# Altium project LPL_Control_board.PrjPcb
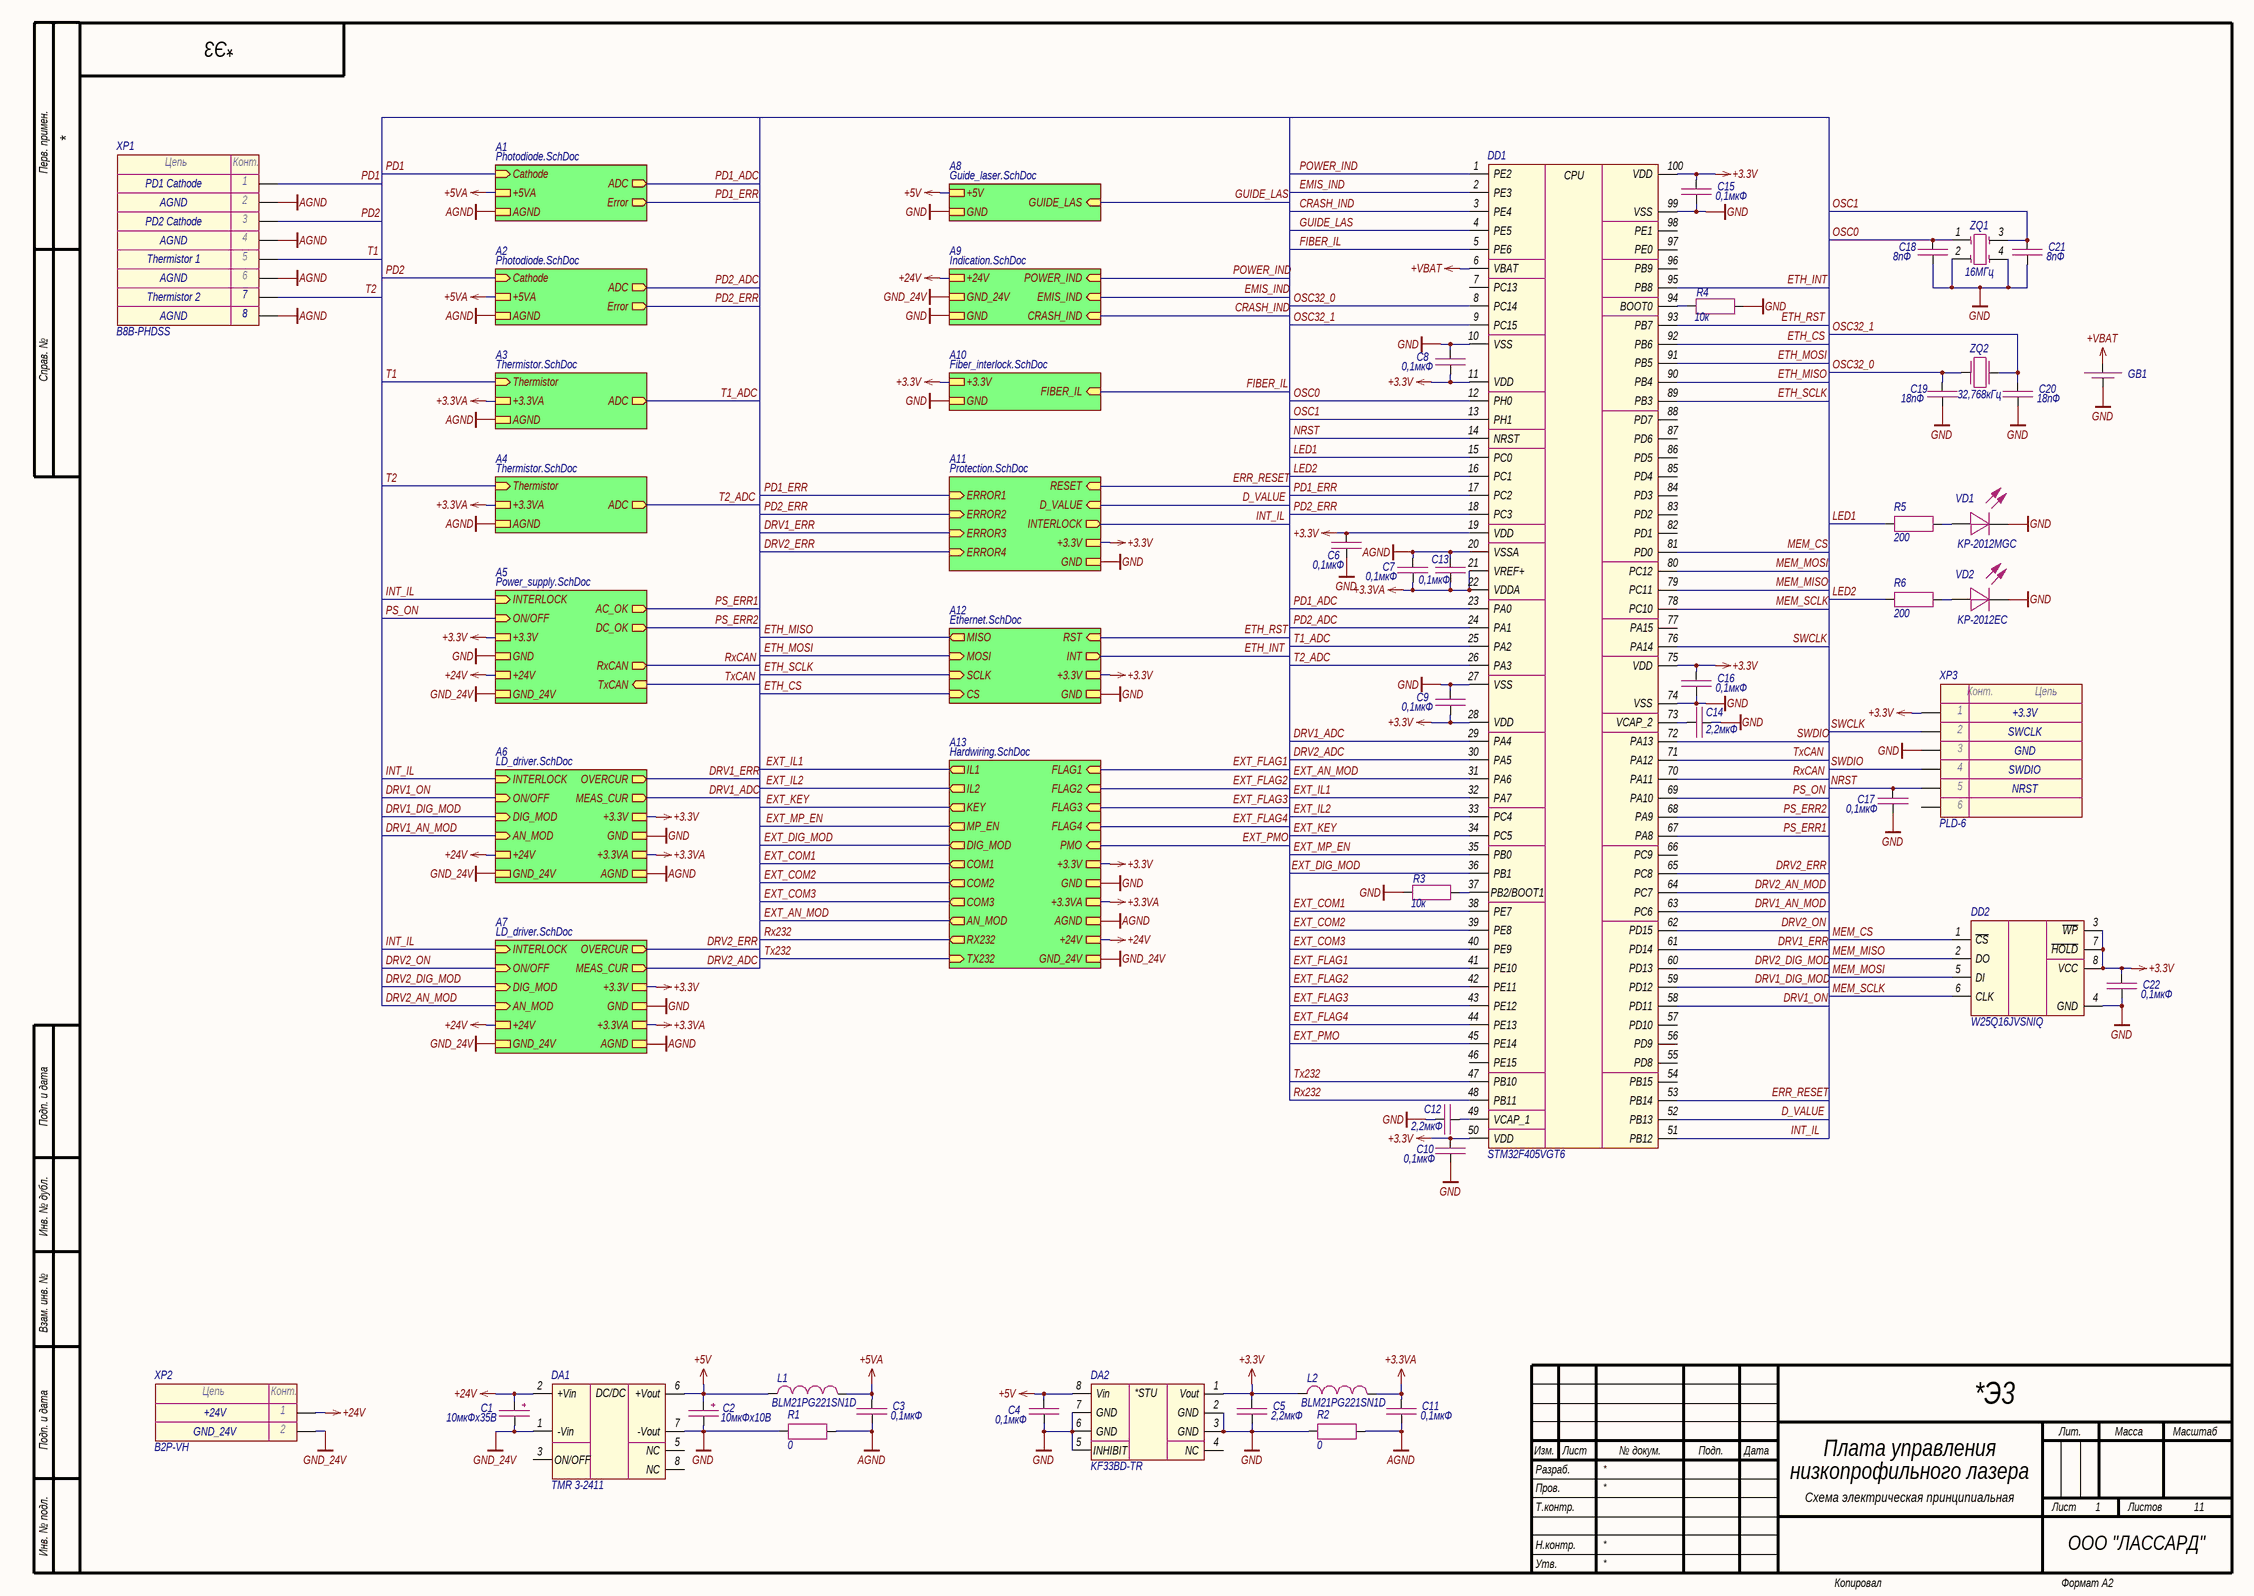
[diagram p0: Main.SchDoc]
11 sheets, 312 parts. Net scope: strictly hierarchical (ports join the sheet entries above them; power ports are local).
Board file: PCB1.PcbDoc
Sheets:
  Main.SchDoc
    A9 = Indication.SchDoc
    A13 = Hardwiring.SchDoc
    A12 = Ethernet.SchDoc
    A1 = Photodiode.SchDoc
    A3 = Thermistor.SchDoc
    A5 = Power_supply.SchDoc
    A6 = LD_driver.SchDoc
    A11 = Protection.SchDoc
    A8 = Guide_laser.SchDoc
    A2 = Photodiode.SchDoc
    A4 = Thermistor.SchDoc
    A7 = LD_driver.SchDoc
    A10 = Fiber_interlock.SchDoc

## Sheet Main.SchDoc: Плата управления
size 594 x 420 mm; CompanyName: ООО "ЛАССАРД"; Address1: Address1; Address2: Address2; Address3: Address3; Address4: Address4; DocumentNumber: *Э3; SheetNumber: 1; SheetTotal: 11; Title2str: низкопрофильного лазера; DocumentType: Схема электрическая принципиальная

### Parts
C1  10мкФх35B  [CAP_C]
C2  10мкФх10B  [CAP_A]
C3  0,1мкФ  [CAP_0603]
C4  0,1мкФ  [CAP_0603]
C5  2,2мкФ  [CAP_0603]
C6  0,1мкФ  [CAP_0603]
C7  0,1мкФ  [CAP_0603]
C8  0,1мкФ  [CAP_0603]
C9  0,1мкФ  [CAP_0603]
C10  0,1мкФ  [CAP_0603]
C11  0,1мкФ  [CAP_0603]
C12  2,2мкФ  [CAP_0603]
C13  0,1мкФ  [CAP_0603]
C14  2,2мкФ  [CAP_0603]
C15  0,1мкФ  [CAP_0603]
C16  0,1мкФ  [CAP_0603]
C17  0,1мкФ  [CAP_0603]
C18  8пФ  [CAP_0603]
C19  18пФ  [CAP_0603]
C20  18пФ  [CAP_0603]
C21  8пФ  [CAP_0603]
C22  0,1мкФ  [CAP_0603]
DA1  TMR 3-2411  [TMR3 (SIP-8)]
DA2  KF33BD-TR  [SOIC-8]
DD1  STM32F405VGT6  [LQFP-100]
DD2  W25Q16JVSNIQ  [SOIC-8]
GB1  DS1092-12-N8S  [DS1092-12-N8S]  (value not drawn)
L1  BLM21PG221SN1D  [IND_0805]
L2  BLM21PG221SN1D  [IND_0805]
R1  0  [RES_0805]
R2  0  [RES_0805]
R3  10к  [RES_0603]
R4  10к  [RES_0603]
R5  200  [RES_0603]
R6  200  [RES_0603]
VD1  KP-2012MGC  [LED_0805]
VD2  KP-2012EC  [LED_0805]
XP1  B8B-PHDSS  [B8B-PHDSS]
XP2  B2P-VH  [B2P-VH]
XP3  PLD-6  [PLD-6]
ZQ1  16МГц  [NX2520SA]
ZQ2  32,768кГц  [NX3215SA]

### Sub-sheets
A1 = Photodiode.SchDoc: Cathode (in), ADC (out), Error (out), AGND, +5VA
A2 = Photodiode.SchDoc: Cathode (in), ADC (out), Error (out), AGND, +5VA
A3 = Thermistor.SchDoc: Thermistor (in), +3.3VA, AGND, ADC (out)
A4 = Thermistor.SchDoc: Thermistor (in), +3.3VA, AGND, ADC (out)
A5 = Power_supply.SchDoc: ON/OFF (in), INTERLOCK (in), +3.3V, GND, +24V, GND_24V, AC_OK (out), DC_OK (out), RxCAN (out), TxCAN (in)
A6 = LD_driver.SchDoc: ON/OFF (in), INTERLOCK (in), DIG_MOD (in), AN_MOD (in), +3.3V, GND, OVERCUR (out), MEAS_CUR (out), +24V, GND_24V, +3.3VA, AGND
A7 = LD_driver.SchDoc: ON/OFF (in), INTERLOCK (in), DIG_MOD (in), AN_MOD (in), +3.3V, GND, OVERCUR (out), MEAS_CUR (out), +24V, GND_24V, +3.3VA, AGND
A8 = Guide_laser.SchDoc: GUIDE_LAS (in), +5V, GND
A9 = Indication.SchDoc: GND_24V, +24V, CRASH_IND (in), POWER_IND (in), EMIS_IND (in), GND
A10 = Fiber_interlock.SchDoc: FIBER_IL (in), +3.3V, GND
A11 = Protection.SchDoc: ERROR1 (in), +3.3V, GND, ERROR2 (in), ERROR3 (in), ERROR4 (in), INTERLOCK (out), RESET (in), D_VALUE (in)
A12 = Ethernet.SchDoc: MISO (out), RST (in), MOSI (in), INT (out), SCLK (in), CS (in), +3.3V, GND
A13 = Hardwiring.SchDoc: IL1 (out), FLAG1 (in), RX232 (out), TX232 (in), IL2 (out), KEY (out), MP_EN (out), AN_MOD (out), FLAG2 (in), FLAG3 (in), FLAG4 (in), PMO (in), +3.3VA, AGND, +3.3V, GND, GND_24V, +24V, COM1 (out), COM2 (out), COM3 (out), DIG_MOD (out)

### Nets
+3.3V: C5.1 C6.1 C8.2 C9.2 C10.2 C15.1 C16.1 C22.1 DA2.1(Vout) DD1.11(VDD) DD1.19(VDD) DD1.28(VDD) DD1.50(VDD) DD1.75(VDD) DD1.100(VDD) DD2.3(~{WP}) DD2.7(~{HOLD}) DD2.8(VCC) L2.1 XP3.1 ; sheet A13/+3.3V, sheet A12/+3.3V, sheet A5/+3.3V, sheet A6/+3.3V, sheet A11/+3.3V, sheet A7/+3.3V, sheet A10/+3.3V
+3.3VA: C7.2 C11.1 C13.2 DD1.21(VREF+) DD1.22(VDDA) L2.2 ; sheet A13/+3.3VA, sheet A3/+3.3VA, sheet A6/+3.3VA, sheet A4/+3.3VA, sheet A7/+3.3VA
+5V: C2.1 C4.1 DA1.6(+Vout) DA2.8(Vin) L1.1 ; sheet A8/+5V
+5VA: C3.1 L1.2 ; sheet A1/+5VA, sheet A2/+5VA
+24V: C1.1 DA1.2(+Vin) XP2.1 ; sheet A9/+24V, sheet A13/+24V, sheet A5/+24V, sheet A6/+24V, sheet A7/+24V
+VBAT: DD1.6(VBAT) GB1.2
AGND: C3.2 C7.1 C11.2 C13.1 DD1.20(VSSA) R1.2 R2.2 XP1.2 XP1.4 XP1.6 XP1.8 ; sheet A13/AGND, sheet A1/AGND, sheet A3/AGND, sheet A6/AGND, sheet A2/AGND, sheet A4/AGND, sheet A7/AGND
GND: C2.2 C4.2 C5.2 C6.2 C8.1 C9.1 C10.1 C12.2 C14.2 C15.2 C16.2 C17.2 C18.2 C19.2 C20.2 C21.2 C22.2 DA1.7(-Vout) DA2.2(GND) DA2.3(GND) DA2.5(INHIBIT) DA2.6(GND) DA2.7(GND) DD1.10(VSS) DD1.27(VSS) DD1.74(VSS) DD1.99(VSS) DD2.4(GND) GB1.1 R1.1 R2.1 R3.2 R4.2 VD1.2(C) VD2.2(C) XP3.3 ZQ1.2 ZQ1.4 ; sheet A9/GND, sheet A13/GND, sheet A12/GND, sheet A5/GND, sheet A6/GND, sheet A11/GND, sheet A8/GND, sheet A7/GND, sheet A10/GND
GND_24V: C1.2 DA1.1(-Vin) XP2.2 ; sheet A9/GND_24V, sheet A13/GND_24V, sheet A5/GND_24V, sheet A6/GND_24V, sheet A7/GND_24V
CRASH_IND: DD1.3(PE4) ; sheet A9/CRASH_IND
D_VALUE: DD1.52(PB13) ; sheet A11/D_VALUE
DRV1_ADC: DD1.29(PA4) ; sheet A6/MEAS_CUR
DRV1_AN_MOD: DD1.63(PC6) ; sheet A6/AN_MOD
DRV1_DIG_MOD: DD1.59(PD12) ; sheet A6/DIG_MOD
DRV1_ERR: DD1.61(PD14) ; sheet A6/OVERCUR, sheet A11/ERROR3
DRV1_ON: DD1.58(PD11) ; sheet A6/ON/OFF
DRV2_ADC: DD1.30(PA5) ; sheet A7/MEAS_CUR
DRV2_AN_MOD: DD1.64(PC7) ; sheet A7/AN_MOD
DRV2_DIG_MOD: DD1.60(PD13) ; sheet A7/DIG_MOD
DRV2_ERR: DD1.65(PC8) ; sheet A11/ERROR4, sheet A7/OVERCUR
DRV2_ON: DD1.62(PD15) ; sheet A7/ON/OFF
EMIS_IND: DD1.2(PE3) ; sheet A9/EMIS_IND
ERR_RESET: DD1.53(PB14) ; sheet A11/RESET
ETH_CS: DD1.92(PB6) ; sheet A12/CS
ETH_INT: DD1.95(PB8) ; sheet A12/INT
ETH_MISO: DD1.90(PB4) ; sheet A12/MISO
ETH_MOSI: DD1.91(PB5) ; sheet A12/MOSI
ETH_RST: DD1.93(PB7) ; sheet A12/RST
ETH_SCLK: DD1.89(PB3) ; sheet A12/SCLK
EXT_AN_MOD: DD1.31(PA6) ; sheet A13/AN_MOD
EXT_COM1: DD1.38(PE7) ; sheet A13/COM1
EXT_COM2: DD1.39(PE8) ; sheet A13/COM2
EXT_COM3: DD1.40(PE9) ; sheet A13/COM3
EXT_DIG_MOD: DD1.36(PB1) ; sheet A13/DIG_MOD
EXT_FLAG1: DD1.41(PE10) ; sheet A13/FLAG1
EXT_FLAG2: DD1.42(PE11) ; sheet A13/FLAG2
EXT_FLAG3: DD1.43(PE12) ; sheet A13/FLAG3
EXT_FLAG4: DD1.44(PE13) ; sheet A13/FLAG4
EXT_IL1: DD1.32(PA7) ; sheet A13/IL1
EXT_IL2: DD1.33(PC4) ; sheet A13/IL2
EXT_KEY: DD1.34(PC5) ; sheet A13/KEY
EXT_MP_EN: DD1.35(PB0) ; sheet A13/MP_EN
EXT_PMO: DD1.45(PE14) ; sheet A13/PMO
FIBER_IL: DD1.5(PE6) ; sheet A10/FIBER_IL
GUIDE_LAS: DD1.4(PE5) ; sheet A8/GUIDE_LAS
INT_IL: DD1.51(PB12) ; sheet A5/INTERLOCK, sheet A6/INTERLOCK, sheet A11/INTERLOCK, sheet A7/INTERLOCK
LED1: DD1.15(PC0) R5.1
LED2: DD1.16(PC1) R6.1
MEM_CS: DD1.81(PD0) DD2.1(~{CS})
MEM_MISO: DD1.79(PC11) DD2.2(DO)
MEM_MOSI: DD1.80(PC12) DD2.5(DI)
MEM_SCLK: DD1.78(PC10) DD2.6(CLK)
NRST: C17.1 DD1.14(NRST) XP3.5
OSC0: C18.1 DD1.12(PH0) ZQ1.1
OSC1: C21.1 DD1.13(PH1) ZQ1.3
OSC32_0: C19.1 DD1.8(PC14) ZQ2.1
OSC32_1: C20.1 DD1.9(PC15) ZQ2.2
PD1: XP1.1 ; sheet A1/Cathode
PD1_ADC: DD1.23(PA0) ; sheet A1/ADC
PD1_ERR: DD1.17(PC2) ; sheet A1/Error, sheet A11/ERROR1
PD2: XP1.3 ; sheet A2/Cathode
PD2_ADC: DD1.24(PA1) ; sheet A2/ADC
PD2_ERR: DD1.18(PC3) ; sheet A11/ERROR2, sheet A2/Error
POWER_IND: DD1.1(PE2) ; sheet A9/POWER_IND
PS_ERR1: DD1.67(PA8) ; sheet A5/AC_OK
PS_ERR2: DD1.68(PA9) ; sheet A5/DC_OK
PS_ON: DD1.69(PA10) ; sheet A5/ON/OFF
Rx232: DD1.48(PB11) ; sheet A13/RX232
RxCAN: DD1.70(PA11) ; sheet A5/RxCAN
SWCLK: DD1.76(PA14) XP3.2
SWDIO: DD1.72(PA13) XP3.4
T1: XP1.5 ; sheet A3/Thermistor
T1_ADC: DD1.25(PA2) ; sheet A3/ADC
T2: XP1.7 ; sheet A4/Thermistor
T2_ADC: DD1.26(PA3) ; sheet A4/ADC
Tx232: DD1.47(PB10) ; sheet A13/TX232
TxCAN: DD1.71(PA12) ; sheet A5/TxCAN
NetC12_1: C12.1 DD1.49(VCAP_1)
NetC14_1: C14.1 DD1.73(VCAP_2)
NetDD1_37: DD1.37(PB2/BOOT1) R3.1
NetDD1_94: DD1.94(BOOT0) R4.1
NetR5_2: R5.2 VD1.1(A)
NetR6_2: R6.2 VD2.1(A)

Not connected (* = marked no-connect by the designer): DA1 3(ON/OFF) 5(NC) 8(NC); DA2 4(NC); DD1 7(PC13) 46(PE15) 54(PB15) 55(PD8) 56(PD9) 57(PD10) 66(PC9) 77(PA15) 82(PD1) 83(PD2) 84(PD3) 85(PD4) 86(PD5) 87(PD6) 88(PD7) 96(PB9) 97(PE0) 98(PE1); XP3 6

### Notes on the sheet
- PD1 Cathode
- AGND
- PD2 Cathode
- Thermistor 1
- Thermistor 2
- +3.3V
- SWCLK
- GND
- NRST
- SWDIO
- +24V
- GND_24V
- Перв. примен.
- Справ. №
- Подп. и дата
- Инв. № дубл.
- Взам. инв. №
- Разраб.
- Изм.
- Лист
- № докум.
- Подп.
- Дата
- Лит.
- Масса
- Масштаб
- Пров.
- Т.контр.
- Листов
- Инв. № подл.
- Утв.
- Н.контр.
- Копировал
- Формат А2
- (in symbol Connector-2) Цепь; Конт.
- (in symbol Connector-8) Цепь; Конт.
- (in symbol KFXXBD-TR) *STU
- (in symbol STM32F405VG) CPU
- (in symbol TMR3) DC/DC

### Library data of the parts
C1 = Capacitor_Polar: Model: TECAP, 10 мкФ, 35 В, тип C, 10%; Value: 10мкФх35B; Document: *; Manufacturer: *
C2 = Capacitor_Polar: Model: TECAP, 10 мкФ, 10 В, тип A, 10%; Value: 10мкФх10B; Document: *; Manufacturer: *
C3 C4 C6-C11 C13 C15-C17 C22 = Capacitor: Manufacturer: Murata; Model: GRM188R71H104KA93D; Value: 0,1мкФ; Document: *
C5 C12 C14 = Capacitor: Manufacturer: Murata; Model: GRM188R61H225KE11D; Value: 2,2мкФ; Document: *
C18 C21 = Capacitor: Manufacturer: Yageo; Model: CC0603CRNPO9BN8R0; Value: 8пФ; Document: *
C19 C20 = Capacitor: Manufacturer: Murata; Model: GRM1885C1H180FA01D; Value: 18пФ; Document: *
DA1 = TMR3: Manufacturer: Traco Power; Model: TMR 3-2411; Document: *
DA2 = KFXXBD-TR: Manufacturer: STMicroelectronics; Model: KF33BD-TR; Document: *
DD1 = STM32F405VG: Manufacturer: STMicroelectronics; Model: STM32F405VGT6; Document: *
DD2 = W25Q: Manufacturer: Winbond; Model: W25Q16JVSNIQ; Document: *
GB1 = Accumulator: Manufacturer: Connfly; Model: DS1092-12-N8S; Document: *
L1 L2 = Inductor: Manufacturer: Murata; Value: *; Model: BLM21PG221SN1D; Document: *
R1 R2 = Resistor: Manufacturer: Yageo; Model: RC0805FR-070RL; Value: 0; Document: *
R3 R4 = Resistor: Manufacturer: Yageo; Model: RC0603FR-0710KL; Value: 10к; Document: *
R5 R6 = Resistor: Manufacturer: Yageo; Model: RC0603FR-07200RL; Value: 200; Document: *
VD1 VD2 = LED: Manufacturer: Kingbright; Document: *
  VD1: Model: KP-2012MGC
  VD2: Model: KP-2012EC
XP1 = Connector-8: Manufacturer: JST; Model: B8B-PHDSS; Document: *
XP2 = Connector-2: Manufacturer: JST; Model: B2P-VH; Document: *
XP3 = Connector-6: Manufacturer: Connfly; Model: PLD-6; Document: *
ZQ1 = Quartz_Resonator_4-pin: Manufacturer: NDK; Model: NX2520SA-16MHZ-STD-CSW-5; Value: 16МГц; Document: *
ZQ2 = Quartz_Resonator: Manufacturer: NDK; Model: NX3215SA- 32.768K-STD-MUA-8; Value: 32,768кГц; Document: *

## Sheet Indication.SchDoc
size 420 x 297 mm; Address1: Address1; Address2: Address2; Address3: Address3; Address4: Address4; DocumentNumber: *Э3; SheetNumber: 7; SheetTotal: 11; DocumentType: Схема электрическая *
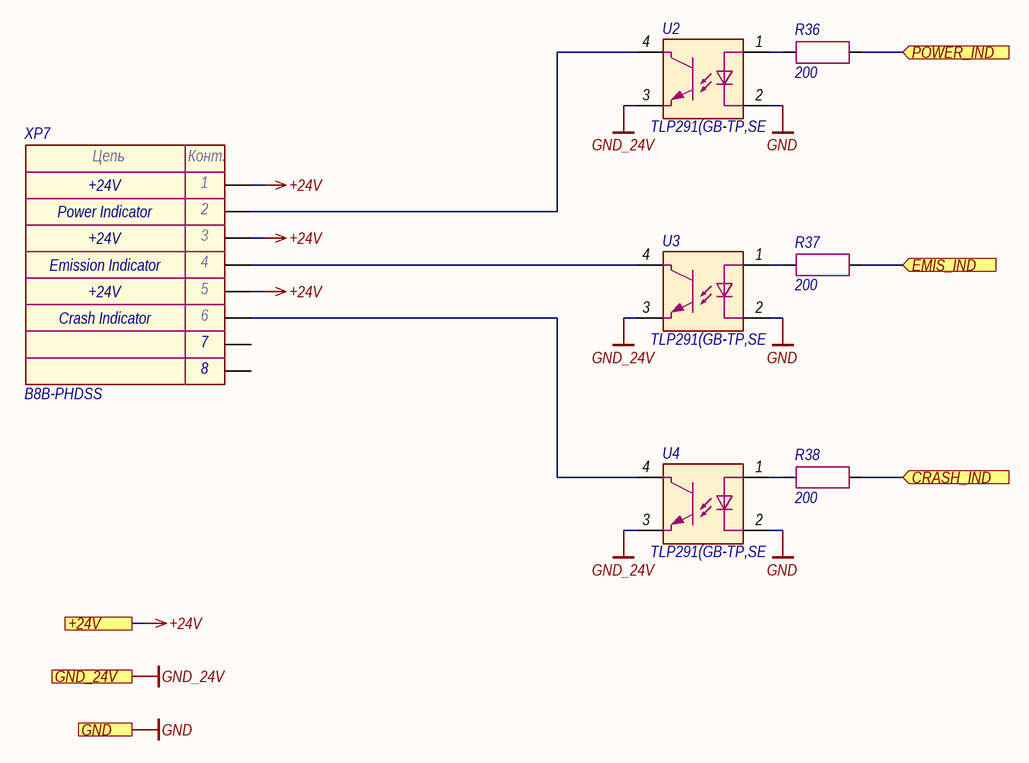
[diagram p1: Indication.SchDoc]

### Parts
R36  200  [RES_0603]
R37  200  [RES_0603]
R38  200  [RES_0603]
U2  TLP291(GB-TP,SE  [11-3C1]
U3  TLP291(GB-TP,SE  [11-3C1]
U4  TLP291(GB-TP,SE  [11-3C1]
XP7  B8B-PHDSS  [B8B-PHDSS]

### Ports
+24V (see Main[2A], Hardwiring[3C], LD_driver[1D], Power_supply[2C]), CRASH_IND (in, see Main[2A]), EMIS_IND (in, see Main[2A]), GND (see Main[2A], Ethernet[3D], Fiber_interlock[2C], Guide_laser[1C], Hardwiring[3D], LD_driver[1D], Power_supply[2D], Protection[2C]), GND_24V (see Main[2A], Hardwiring[3C], LD_driver[1D], Power_supply[2C]), POWER_IND (in, see Main[2A])

### Nets
+24V: XP7.1 XP7.3 XP7.5 ; port +24V
GND: U2.2 U3.2 U4.2 ; port GND
GND_24V: U2.3 U3.3 U4.3 ; port GND_24V
CRASH_IND: R38.2 ; port CRASH_IND
EMIS_IND: R37.2 ; port EMIS_IND
POWER_IND: R36.2 ; port POWER_IND
NetR36_1: R36.1 U2.1
NetR37_1: R37.1 U3.1
NetR38_1: R38.1 U4.1
NetU2_4: U2.4 XP7.2
NetU3_4: U3.4 XP7.4
NetU4_4: U4.4 XP7.6

Not connected (* = marked no-connect by the designer): XP7 7 8

### Notes on the sheet
- Power Indicator
- +24V
- (near XP7) Emission Indicator
- Crash Indicator
- Подп. и дата
- Инв. № дубл.
- Взам. инв. №
- Инв. № подл.
- Изм.
- Лист
- № докум.
- Подп.
- Дата
- Копировал
- Формат А3
- (in symbol Connector-8) Цепь; Конт.

### Library data of the parts
R36-R38 = Resistor: as R5 on sheet Main; Value: 200; Document: *
U2-U4 = TLP291: Manufacturer: Toshiba; Model: TLP291(GB-TP,SE; Document: *
XP7 = Connector-8: Manufacturer: JST; Model: B8B-PHDSS; Document: *

## Sheet Hardwiring.SchDoc
size 594 x 420 mm; Address1: Address1; Address2: Address2; Address3: Address3; Address4: Address4; DocumentNumber: *Э3; SheetNumber: 11; SheetTotal: 11; DocumentType: Схема электрическая *
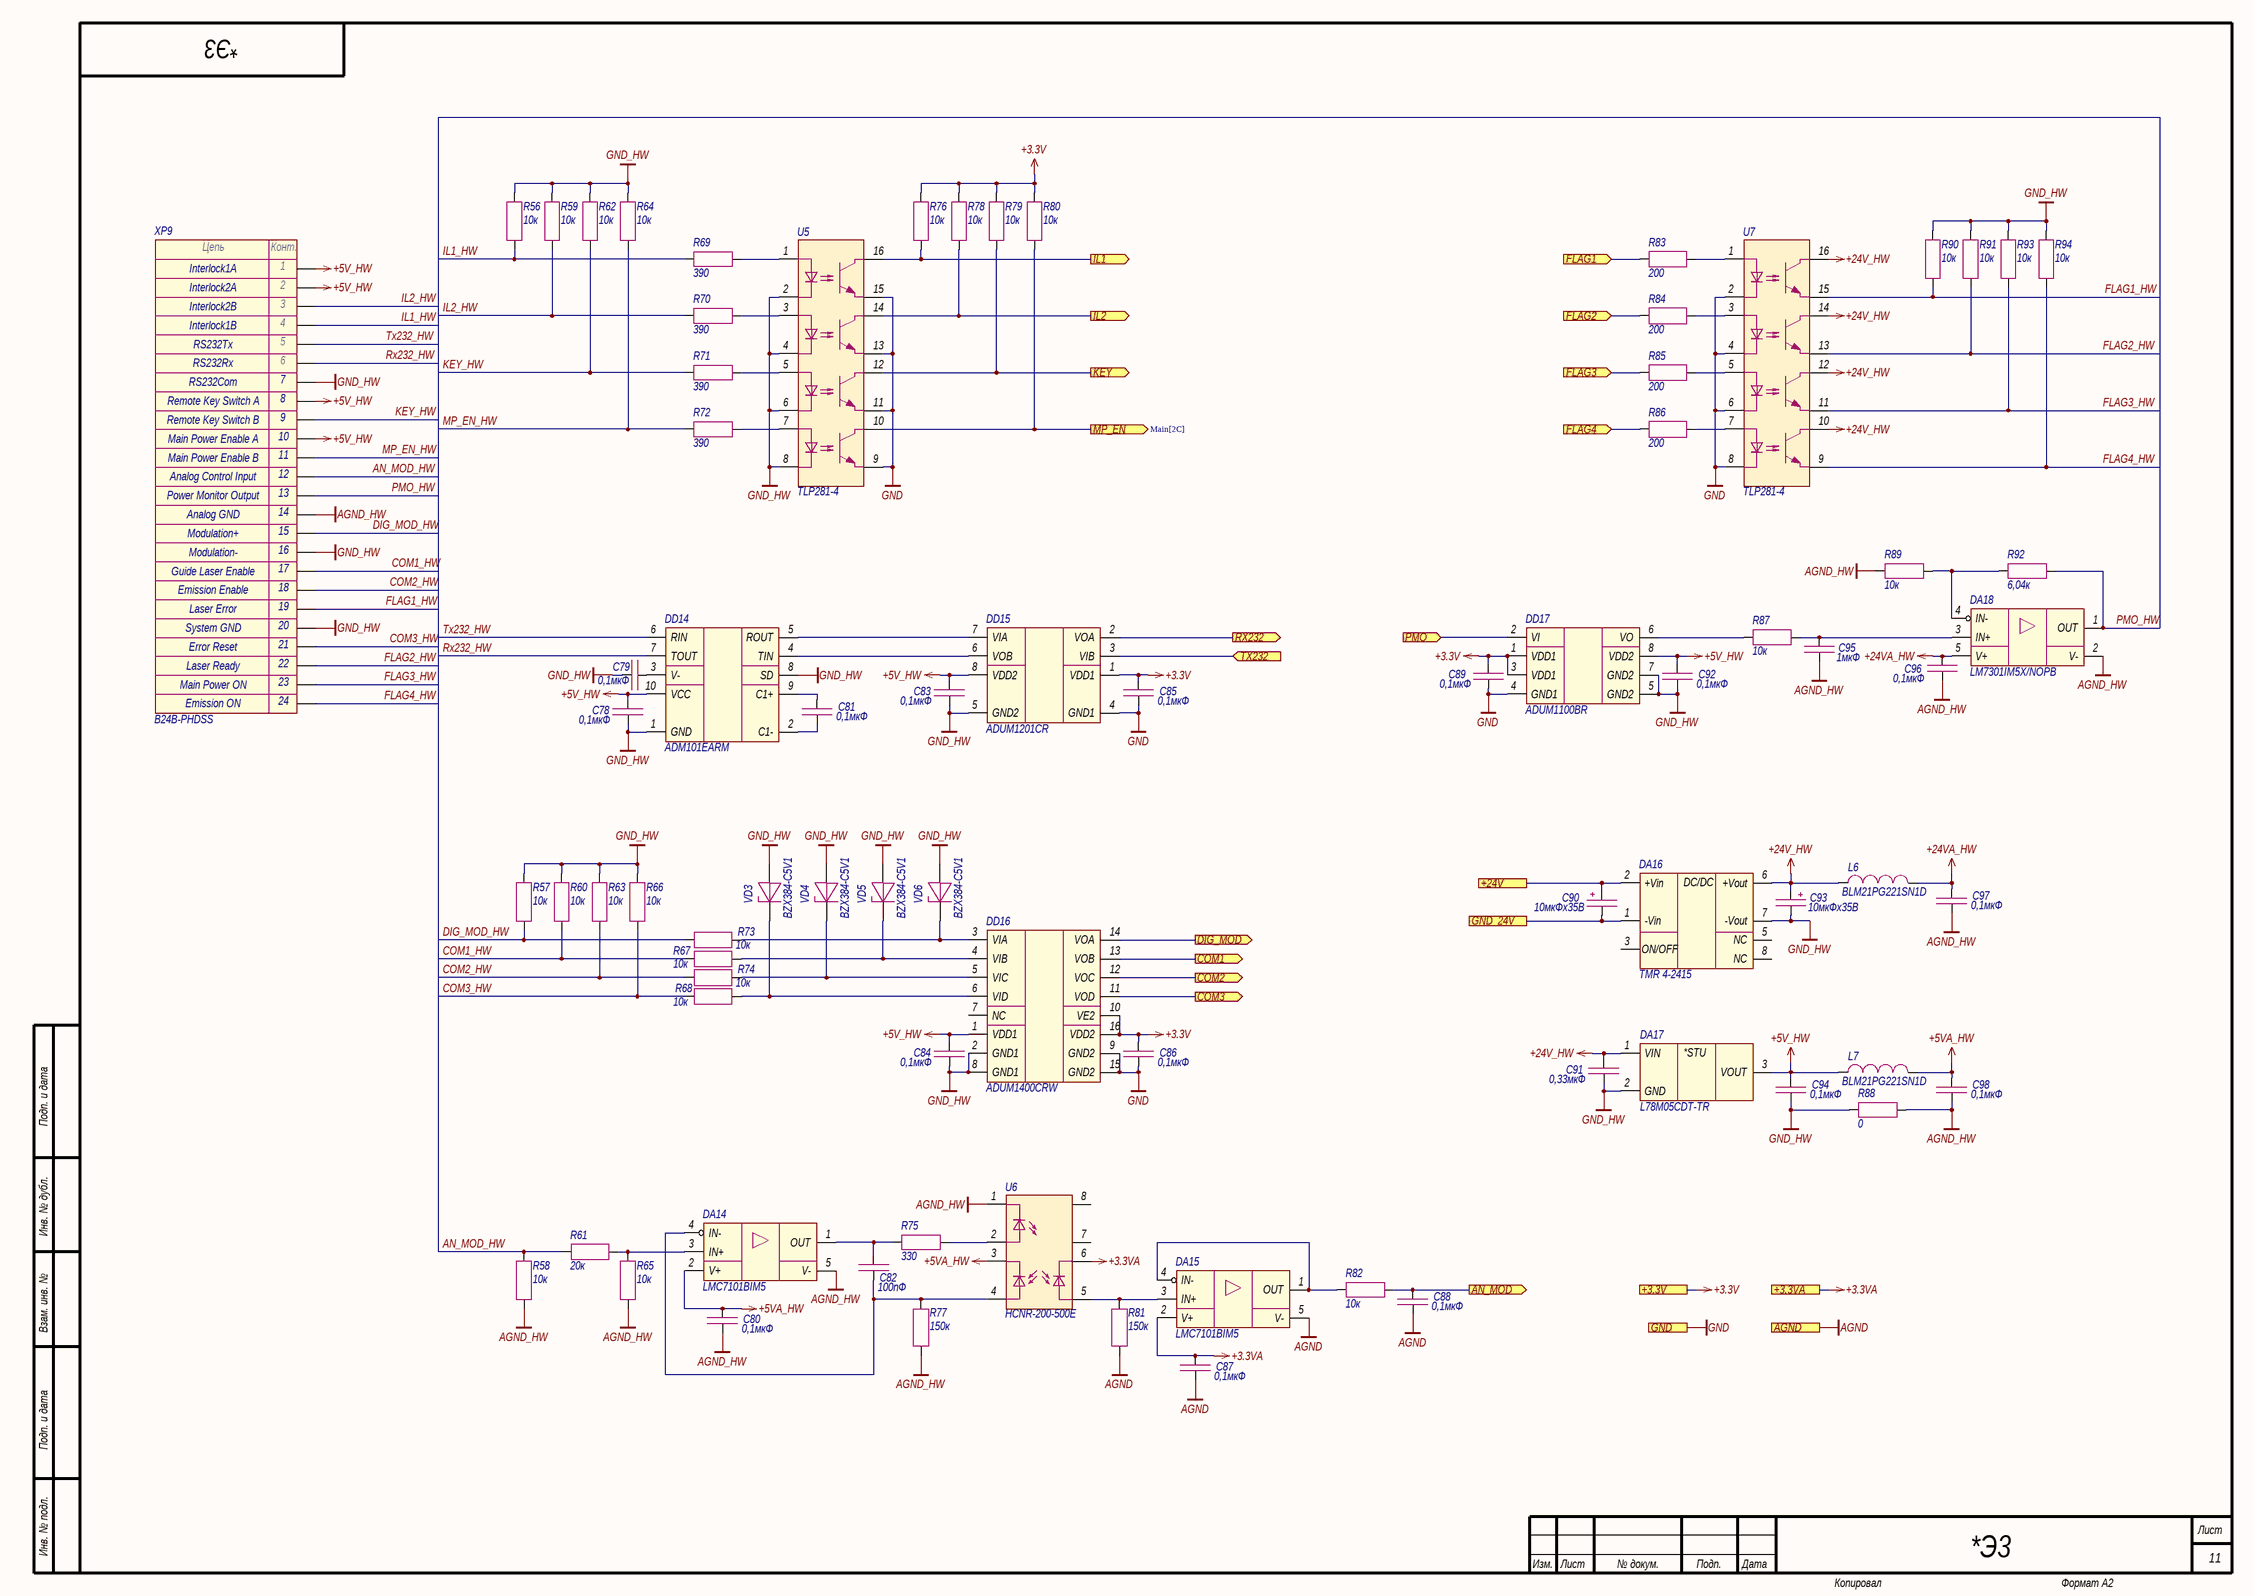
[diagram p2: Hardwiring.SchDoc]

### Parts
C78  0,1мкФ  [CAP_0603]
C79  0,1мкФ  [CAP_0603]
C80  0,1мкФ  [CAP_0603]
C81  0,1мкФ  [CAP_0603]
C82  100пФ  [CAP_0603]
C83  0,1мкФ  [CAP_0603]
C84  0,1мкФ  [CAP_0603]
C85  0,1мкФ  [CAP_0603]
C86  0,1мкФ  [CAP_0603]
C87  0,1мкФ  [CAP_0603]
C88  0,1мкФ  [CAP_0603]
C89  0,1мкФ  [CAP_0603]
C90  10мкФх35B  [CAP_C]
C91  0,33мкФ  [CAP_0805]
C92  0,1мкФ  [CAP_0603]
C93  10мкФх35B  [CAP_C]
C94  0,1мкФ  [CAP_0603]
C95  1мкФ  [CAP_0603]
C96  0,1мкФ  [CAP_0603]
C97  0,1мкФ  [CAP_0603]
C98  0,1мкФ  [CAP_0603]
DA14  LMC7101BIM5  [SOT-23-5]
DA15  LMC7101BIM5  [SOT-23-5]
DA16  TMR 4-2415  [TMR4 (SIP-8)]
DA17  L78M05CDT-TR  [TO-252]
DA18  LM7301IM5X/NOPB  [SOT-23-5]
DD14  ADM101EARM  [MSOP-10]
DD15  ADUM1201CR  [SOIC-8]
DD16  ADUM1400CRW  [SOIC-16W]
DD17  ADUM1100BR  [SOIC-8]
L6  BLM21PG221SN1D  [IND_0805]
L7  BLM21PG221SN1D  [IND_0805]
R56  10к  [RES_0603]
R57  10к  [RES_0603]
R58  10к  [RES_0603]
R59  10к  [RES_0603]
R60  10к  [RES_0603]
R61  20к  [RES_0603]
R62  10к  [RES_0603]
R63  10к  [RES_0603]
R64  10к  [RES_0603]
R65  10к  [RES_0603]
R66  10к  [RES_0603]
R67  10к  [RES_0603]
R68  10к  [RES_0603]
R69  390  [RES_0603]
R70  390  [RES_0603]
R71  390  [RES_0603]
R72  390  [RES_0603]
R73  10к  [RES_0603]
R74  10к  [RES_0603]
R75  330  [RES_0603]
R76  10к  [RES_0603]
R77  150к  [RES_0603]
R78  10к  [RES_0603]
R79  10к  [RES_0603]
R80  10к  [RES_0603]
R81  150к  [RES_0603]
R82  10к  [RES_0603]
R83  200  [RES_0603]
R84  200  [RES_0603]
R85  200  [RES_0603]
R86  200  [RES_0603]
R87  10к  [RES_0603]
R88  0  [RES_0805]
R89  10к  [RES_0603]
R90  10к  [RES_0603]
R91  10к  [RES_0603]
R92  6,04к  [RES_0603]
R93  10к  [RES_0603]
R94  10к  [RES_0603]
U5  TLP281-4  [SOP-16]
U6  HCNR-200-500E  [HCNR200]
U7  TLP281-4  [SOP-16]
VD3  BZX384-C5V1  [SOD-323]
VD4  BZX384-C5V1  [SOD-323]
VD5  BZX384-C5V1  [SOD-323]
VD6  BZX384-C5V1  [SOD-323]
XP9  B24B-PHDSS  [B24B-PHDSS]

### Ports
+3.3V (see Main[2C], Ethernet[3D], Fiber_interlock[2C], LD_driver[1D], Power_supply[2D], Protection[2C]), +3.3VA (see Main[2C], LD_driver[2D], Thermistor[2C]), +24V (see Main[2C], Indication[1C], LD_driver[1D], Power_supply[2C]), AGND (see Main[2C], LD_driver[2D], Photodiode[1C], Thermistor[2C]), AN_MOD (out, see Main[2C]), COM1 (out, see Main[2C]), COM2 (out, see Main[2C]), COM3 (out, see Main[2C]), DIG_MOD (out, see Main[2C]), FLAG1 (in, see Main[2B]), FLAG2 (in, see Main[2B]), FLAG3 (in, see Main[2C]), FLAG4 (in, see Main[2C]), GND (see Main[2C], Ethernet[3D], Fiber_interlock[2C], Guide_laser[1C], Indication[1C], LD_driver[1D], Power_supply[2D], Protection[2C]), GND_24V (see Main[2C], Indication[1C], LD_driver[1D], Power_supply[2C]), IL1 (out, see Main[2B]), IL2 (out, see Main[2B]), KEY (out, see Main[2C]), MP_EN (out, see Main[2C]), PMO (in, see Main[2C]), RX232 (out, see Main[2C]), TX232 (in, see Main[2C])

### Nets
+3.3V: C85.1 C86.1 C89.1 DD15.1(VDD1) DD16.10(VE2) DD16.16(VDD2) DD17.1(VDD1) DD17.3(VDD1) R76.1 R78.1 R79.1 R80.1 ; port +3.3V
+3.3VA: C87.1 DA15.2(V+) U6.6 ; port +3.3VA
+5V_HW: C78.1 C83.1 C84.1 C92.1 C94.1 DA17.3(VOUT) DD14.10(VCC) DD15.8(VDD2) DD16.1(VDD1) DD17.8(VDD2) L7.1 XP9.1 XP9.2 XP9.8 XP9.10
+5VA_HW: C80.1 C98.1 DA14.2(V+) L7.2 U6.3
+24V: C90.1 DA16.2(+Vin) ; port +24V
+24V_HW: C91.2 C93.1 DA16.6(+Vout) DA17.1(VIN) L6.1 U7.10 U7.12 U7.14 U7.16
+24VA_HW: C96.1 C97.1 DA18.5(V+) L6.2
AGND: C87.2 C88.2 DA15.5(V-) R81.2 ; port AGND
AGND_HW: C80.2 C95.2 C96.2 C97.2 C98.2 DA14.5(V-) DA18.2(V-) R58.2 R65.2 R77.2 R88.2 R89.1 U6.1 XP9.14
GND: C85.2 C86.2 C89.2 DD15.4(GND1) DD16.9(GND2) DD16.15(GND2) DD17.4(GND1) U5.9 U5.11 U5.13 U5.15 U7.2 U7.4 U7.6 U7.8 ; port GND
GND_24V: C90.2 DA16.1(-Vin) ; port GND_24V
GND_HW: C78.2 C79.2 C83.2 C84.2 C91.1 C92.2 C93.2 C94.2 DA16.7(-Vout) DA17.2(GND) DD14.1(GND) DD14.8(SD) DD15.5(GND2) DD16.2(GND1) DD16.8(GND1) DD17.5(GND2) DD17.7(GND2) R56.1 R57.1 R59.1 R60.1 R62.1 R63.1 R64.1 R66.1 R88.1 R90.1 R91.1 R93.1 R94.1 U5.2 U5.4 U5.6 U5.8 VD3.2(A) VD4.2(A) VD5.2(A) VD6.2(A) XP9.7 XP9.16 XP9.20
AN_MOD_HW: R58.1 R61.1 XP9.12
COM1_HW: R60.2 R67.1 XP9.17
COM2_HW: R63.2 R74.1 XP9.18
COM3_HW: R66.2 R68.1 XP9.21
DIG_MOD_HW: R57.2 R73.1 XP9.15
EXT_AN_MOD: C88.1 R82.2 ; port AN_MOD
EXT_COM1: DD16.13(VOB) ; port COM1
EXT_COM2: DD16.12(VOC) ; port COM2
EXT_COM3: DD16.11(VOD) ; port COM3
EXT_DIG_MOD: DD16.14(VOA) ; port DIG_MOD
EXT_FLAG1: R83.2 ; port FLAG1
EXT_FLAG2: R84.2 ; port FLAG2
EXT_FLAG3: R85.2 ; port FLAG3
EXT_FLAG4: R86.2 ; port FLAG4
EXT_IL1: R76.2 U5.16 ; port IL1
EXT_IL2: R78.2 U5.14 ; port IL2
EXT_KEY: R79.2 U5.12 ; port KEY
EXT_MP_EN: R80.2 U5.10 ; port MP_EN
EXT_PMO: DD17.2(VI) ; port PMO
FLAG1_HW: R90.2 U7.15 XP9.19
FLAG2_HW: R91.2 U7.13 XP9.22
FLAG3_HW: R93.2 U7.11 XP9.23
FLAG4_HW: R94.2 U7.9 XP9.24
IL1_HW: R56.2 R69.1 XP9.4
IL2_HW: R59.2 R70.1 XP9.3
KEY_HW: R62.2 R71.1 XP9.9
MP_EN_HW: R64.2 R72.1 XP9.11
PMO_HW: DA18.1(OUT) R92.2 XP9.13
Rx232: DD15.2(VOA) ; port RX232
Rx232_HW: DD14.7(TOUT) XP9.6
Tx232: DD15.3(VIB) ; port TX232
Tx232_HW: DD14.6(RIN) XP9.5
NetC79_1: C79.1 DD14.3(V-)
NetC81_1: C81.1 DD14.9(C1+)
NetC81_2: C81.2 DD14.2(C1-)
NetC82_1: C82.1 DA14.1(OUT) R75.1
NetC82_2: C82.2 DA14.4(IN-) R77.1 U6.4
NetC95_1: C95.1 DA18.3(IN+) R87.2
NetDA14_3: DA14.3(IN+) R61.2 R65.1
NetDA15_1: DA15.1(OUT) DA15.4(IN-) R82.1
NetDA15_3: DA15.3(IN+) R81.1 U6.5
NetDA18_4: DA18.4(IN-) R89.2 R92.1
NetDD14_4: DD14.4(TIN) DD15.6(VOB)
NetDD14_5: DD14.5(ROUT) DD15.7(VIA)
NetDD16_3: DD16.3(VIA) R73.2 VD6.1(K)
NetDD16_4: DD16.4(VIB) R67.2 VD5.1(K)
NetDD16_5: DD16.5(VIC) R74.2 VD4.1(K)
NetDD16_6: DD16.6(VID) R68.2 VD3.1(K)
NetDD17_6: DD17.6(VO) R87.1
NetR69_2: R69.2 U5.1
NetR70_2: R70.2 U5.3
NetR71_2: R71.2 U5.5
NetR72_2: R72.2 U5.7
NetR75_2: R75.2 U6.2
NetR83_1: R83.1 U7.1
NetR84_1: R84.1 U7.3
NetR85_1: R85.1 U7.5
NetR86_1: R86.1 U7.7

Not connected (* = marked no-connect by the designer): DA16 3(ON/OFF) 5(NC) 8(NC); DD16 7(NC); U6 7 8

### Notes on the sheet
- Interlock1A
- Interlock2A
- Interlock2B
- Interlock1B
- RS232Tx
- RS232Rx
- RS232Com
- (near XP9) Remote Key Switch A
- (near XP9) Remote Key Switch B
- (near XP9) Main Power Enable A
- (near XP9) Main Power Enable B
- (near XP9) Analog Control Input
- (near XP9) Power Monitor Output
- Analog GND
- Modulation+
- Modulation-
- (near XP9) Guide Laser Enable
- (near XP9) Emission Enable
- System GND
- Error Reset
- Laser Error
- Main Power ON
- Emission ON
- Laser Ready
- Подп. и дата
- Инв. № дубл.
- Взам. инв. №
- Инв. № подл.
- Изм.
- Лист
- № докум.
- Подп.
- Дата
- Копировал
- Формат А2
- (in symbol Connector-24) Цепь; Конт.
- (in symbol L78M) *STU
- (in symbol TMR4) DC/DC

### Library data of the parts
C78-C81 C83-C89 C92 C94 C96-C98 = Capacitor: as C3 on sheet Main; Value: 0,1мкФ; Document: *
C82 = Capacitor: Manufacturer: Murata; Model: GRM1885C1H101JA01D; Value: 100пФ; Document: *
C90 C93 = Capacitor_Polar: Model: TECAP, 10 мкФ, 35 В, тип C, 10%; Value: 10мкФх35B; Document: *; Manufacturer: *
C91 = Capacitor: Manufacturer: Murata; Model: GRM219R71H334KA88D; Value: 0,33мкФ; Document: *
C95 = Capacitor: Manufacturer: Murata; Model: GRM188R61H105KAALD; Value: 1мкФ; Document: *
DA14 DA15 = LMC7101: Manufacturer: Texas Instruments; Model: LMC7101BIM5; Document: *
DA16 = TMR4: Manufacturer: Traco Power; Model: TMR 4-2415; Document: *
DA17 = L78M: Manufacturer: STMicroelectronics; Model: L78M05CDT-TR; Document: *
DA18 = LM7301IM5: Manufacturer: Texas Instruments; Model: LM7301IM5X/NOPB; Document: *
DD14 = ADM101EARM: Manufacturer: Analog Devices; Model: ADM101EARM; Document: *
DD15 = ADUM1201: Manufacturer: Analog Devices; Model: ADUM1201CR; Document: *
DD16 = ADUM1400: Manufacturer: Analog Devices; Model: ADUM1400CRW; Document: *
DD17 = ADUM1100: Manufacturer: Analog Devices; Model: ADUM1100BR; Document: *
L6 L7 = Inductor: Manufacturer: Murata; Value: *; Model: BLM21PG221SN1D; Document: *
R56-R60 R62-R68 R73 R74 R76 R78-R80 R82 R87 R89-R91 R93 R94 = Resistor: as R3 on sheet Main; Value: 10к; Document: *
R61 = Resistor: Manufacturer: Yageo; Model: RC0603FR-0720KL; Value: 20к; Document: *
R69-R72 = Resistor: Manufacturer: Yageo; Model: RC0603FR-07390RL; Value: 390; Document: *
R75 = Resistor: Manufacturer: Yageo; Model: RC0603FR-07330RL; Value: 330; Document: *
R77 R81 = Resistor: Manufacturer: Yageo; Model: RC0603FR-07150KL; Value: 150к; Document: *
R83-R86 = Resistor: as R5 on sheet Main; Value: 200; Document: *
R88 = Resistor: as R1 on sheet Main; Value: 0; Document: *
R92 = Resistor: Manufacturer: Yageo; Model: RC0603FR-076K04L; Value: 6,04к; Document: *
U5 U7 = TLP281-4: Manufacturer: Toshiba; Model: TLP281-4; Document: *
U6 = HCNR200: Manufacturer: Avago; Model: HCNR-200-500E; Document: *
VD3-VD6 = Diode_Zener: Manufacturer: Nexperia; Model: BZX384-C5V1; Document: *
XP9 = Connector-24: Manufacturer: JST; Model: B24B-PHDSS; Document: *

## Sheet Ethernet.SchDoc
size 420 x 297 mm; Address1: Address1; Address2: Address2; Address3: Address3; Address4: Address4; DocumentNumber: *Э3; SheetNumber: 10; SheetTotal: 11; DocumentType: Схема электрическая *
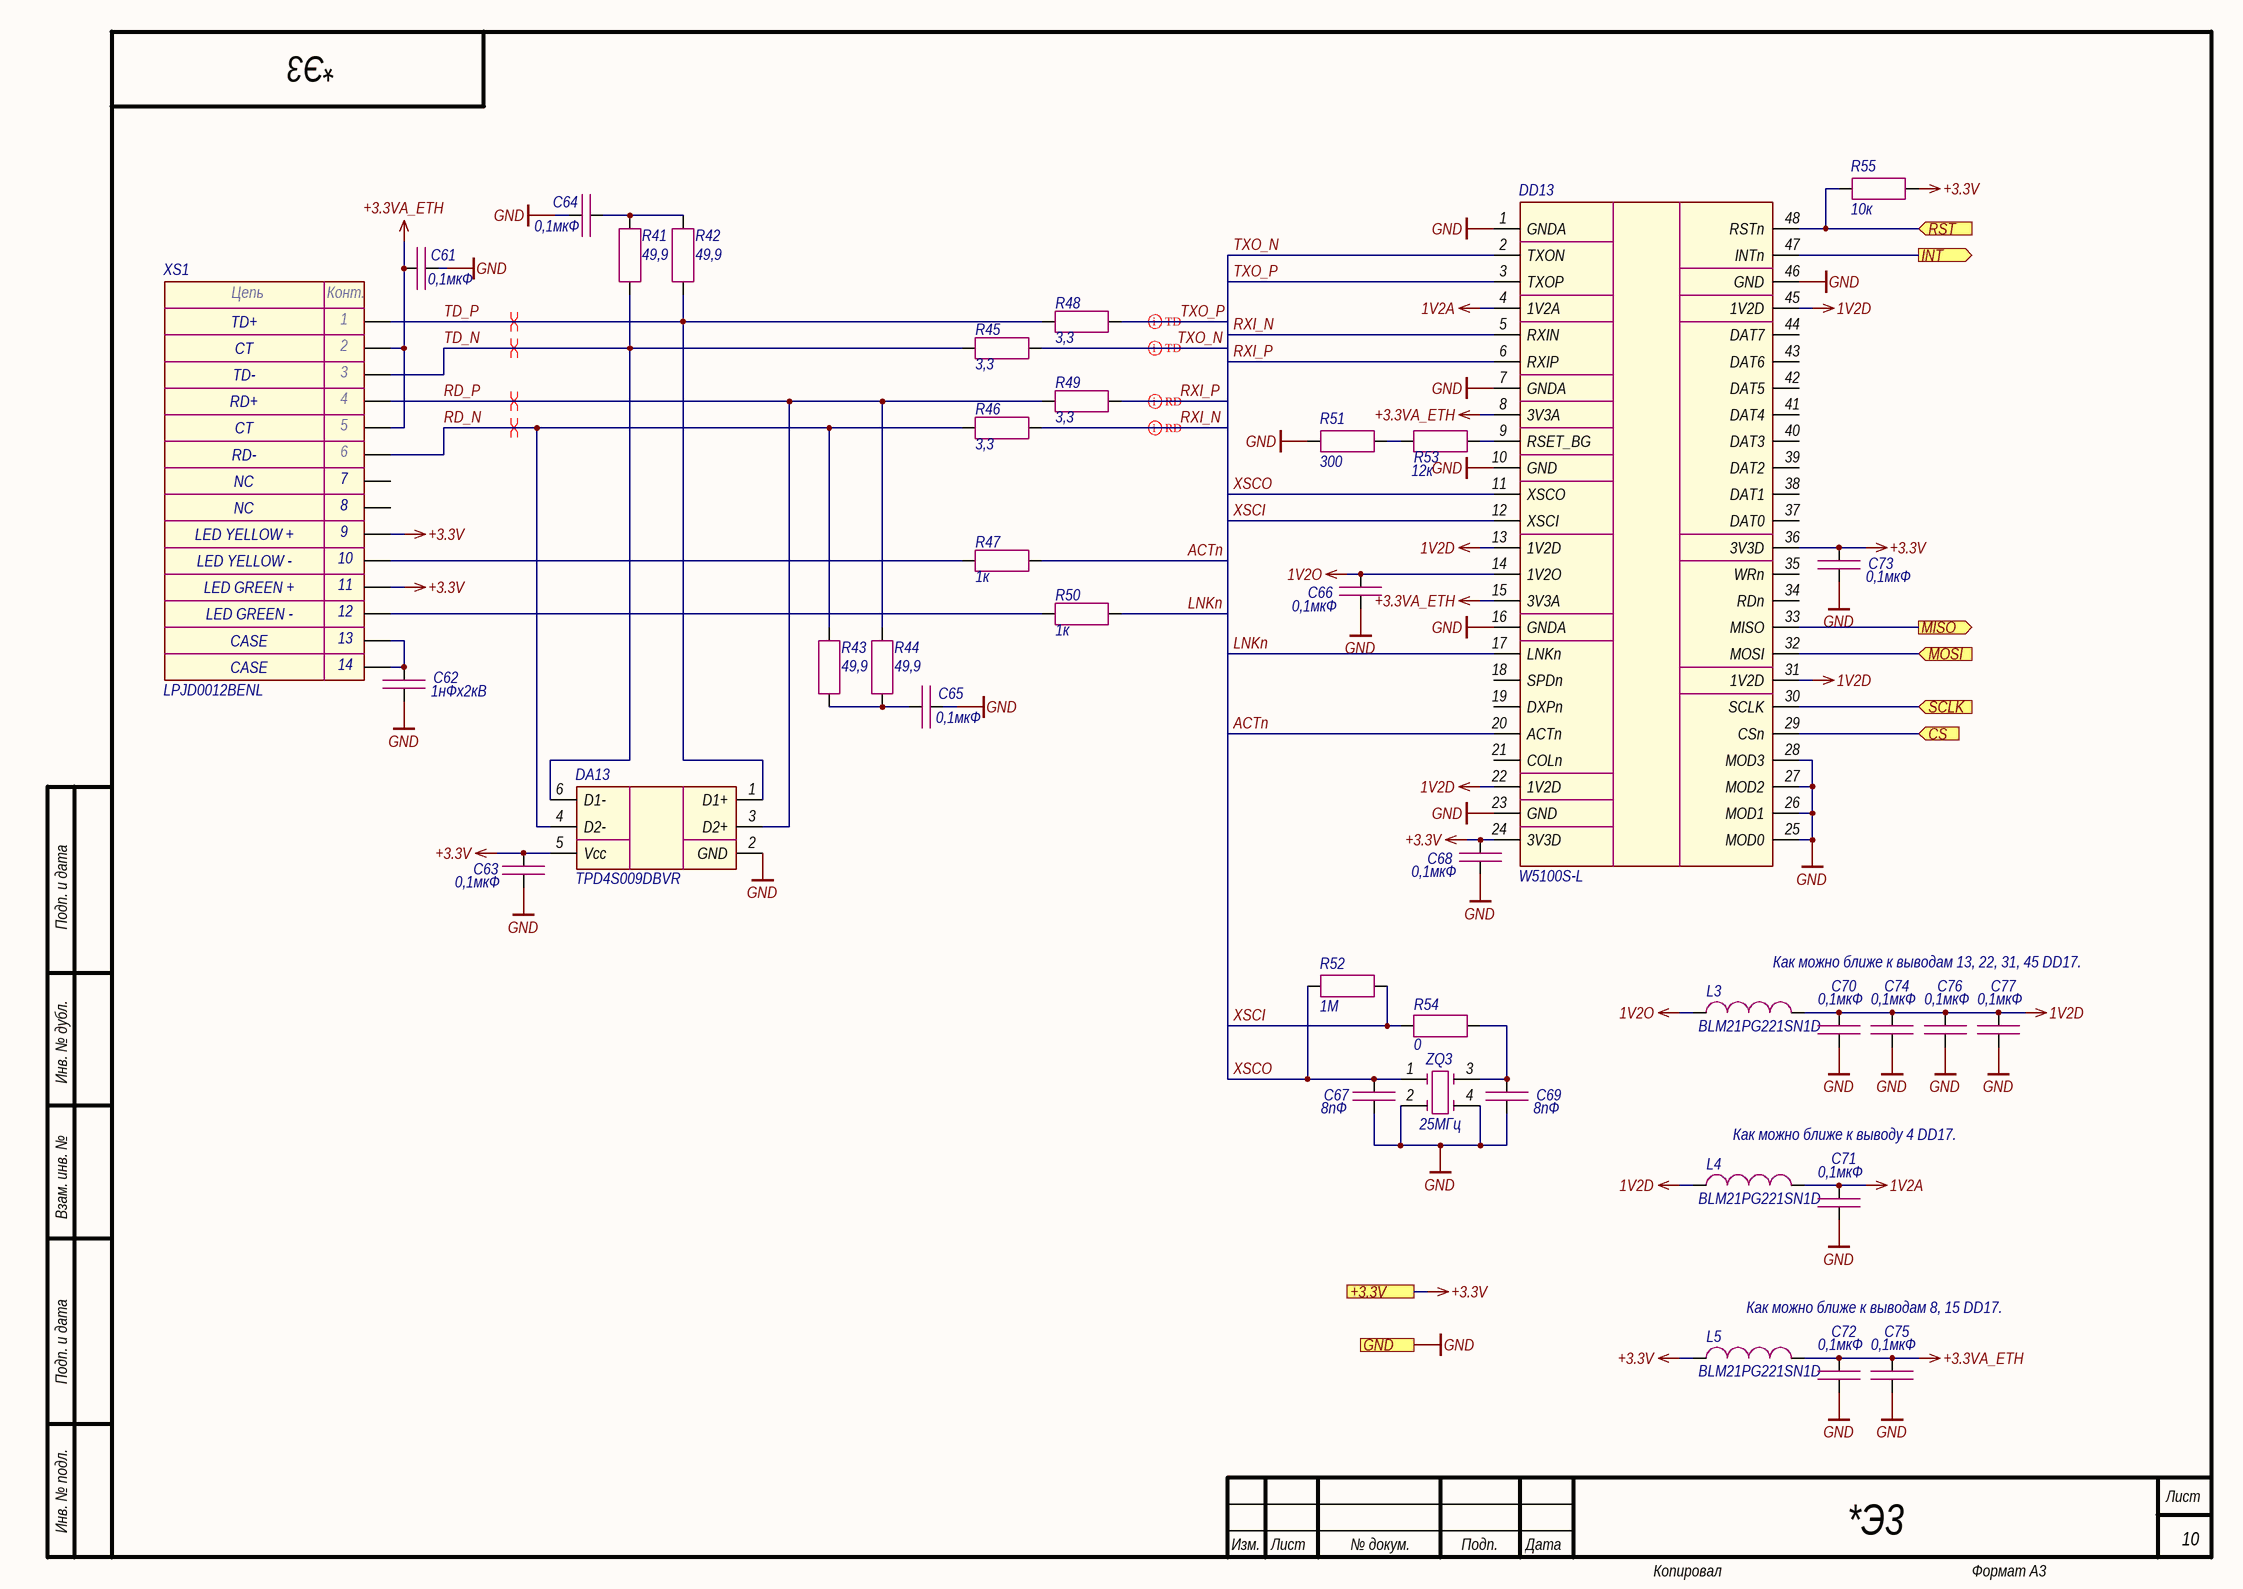
[diagram p3: Ethernet.SchDoc]

### Parts
C61  0,1мкФ  [CAP_0603]
C62  1нФх2кВ  [CAP_1206]
C63  0,1мкФ  [CAP_0603]
C64  0,1мкФ  [CAP_0603]
C65  0,1мкФ  [CAP_0603]
C66  0,1мкФ  [CAP_0603]
C67  8пФ  [CAP_0603]
C68  0,1мкФ  [CAP_0603]
C69  8пФ  [CAP_0603]
C70  0,1мкФ  [CAP_0603]
C71  0,1мкФ  [CAP_0603]
C72  0,1мкФ  [CAP_0603]
C73  0,1мкФ  [CAP_0603]
C74  0,1мкФ  [CAP_0603]
C75  0,1мкФ  [CAP_0603]
C76  0,1мкФ  [CAP_0603]
C77  0,1мкФ  [CAP_0603]
DA13  TPD4S009DBVR  [SOT-23-6]
DD13  W5100S-L  [LQFP-48]
L3  BLM21PG221SN1D  [IND_0805]
L4  BLM21PG221SN1D  [IND_0805]
L5  BLM21PG221SN1D  [IND_0805]
R41  49,9  [RES_0603]
R42  49,9  [RES_0603]
R43  49,9  [RES_0603]
R44  49,9  [RES_0603]
R45  3,3  [RES_0603]
R46  3,3  [RES_0603]
R47  1к  [RES_0603]
R48  3,3  [RES_0603]
R49  3,3  [RES_0603]
R50  1к  [RES_0603]
R51  300  [RES_0603]
R52  1М  [RES_0603]
R53  12к  [RES_0603]
R54  0  [RES_0603]
R55  10к  [RES_0603]
XS1  LPJD0012BENL  [LPJD0012BENL]
ZQ3  25МГц  [7M]

### Ports
+3.3V (see Main[2B], Fiber_interlock[2C], Hardwiring[3D], LD_driver[1D], Power_supply[2D], Protection[2C]), CS (in, see Main[2B]), GND (see Main[2B], Fiber_interlock[2C], Guide_laser[1C], Hardwiring[3D], Indication[1C], LD_driver[1D], Power_supply[2D], Protection[2C]), INT (out, see Main[2B]), MISO (out, see Main[2B]), MOSI (in, see Main[2B]), RST (in, see Main[2B]), SCLK (in, see Main[2B])

### Nets
1V2A: C71.1 DD13.4(1V2A) L4.2
1V2D: C70.1 C74.1 C76.1 C77.1 DD13.13(1V2D) DD13.22(1V2D) DD13.31(1V2D) DD13.45(1V2D) L3.2 L4.1
1V2O: C66.1 DD13.14(1V2O) L3.1
+3.3V: C63.1 C68.1 C73.1 DA13.5(Vcc) DD13.24(3V3D) DD13.36(3V3D) L5.1 R55.2 XS1.9 XS1.11 ; port +3.3V
+3.3VA_ETH: C61.1 C72.1 C75.1 DD13.8(3V3A) DD13.15(3V3A) L5.2 XS1.2 XS1.5
GND: C61.2 C62.2 C63.2 C64.2 C65.2 C66.2 C67.2 C68.2 C69.2 C70.2 C71.2 C72.2 C73.2 C74.2 C75.2 C76.2 C77.2 DA13.2(GND) DD13.1(GNDA) DD13.7(GNDA) DD13.10(GND) DD13.16(GNDA) DD13.23(GND) DD13.25(MOD0) DD13.26(MOD1) DD13.27(MOD2) DD13.28(MOD3) DD13.46(GND) R51.1 ZQ3.2 ZQ3.4 ; port GND
ACTn: DD13.20(ACTn) R47.2
ETH_CS: DD13.29(CSn) ; port CS
ETH_INT: DD13.47(INTn) ; port INT
ETH_MISO: DD13.33(MISO) ; port MISO
ETH_MOSI: DD13.32(MOSI) ; port MOSI
ETH_RST: DD13.48(RSTn) R55.1 ; port RST
ETH_SCLK: DD13.30(SCLK) ; port SCLK
LNKn: DD13.17(LNKn) R50.2
RD_N: DA13.4(D2-) R43.1 R46.2 XS1.6
RD_P: DA13.3(D2+) R44.1 R49.2 XS1.4
RXI_N: DD13.5(RXIN) R46.1
RXI_P: DD13.6(RXIP) R49.1
TD_N: DA13.6(D1-) R41.1 R45.2 XS1.3
TD_P: DA13.1(D1+) R42.1 R48.2 XS1.1
TXO_N: DD13.2(TXON) R45.1
TXO_P: DD13.3(TXOP) R48.1
XSCI: DD13.12(XSCI) R52.2 R54.1
XSCO: C67.1 DD13.11(XSCO) R52.1 ZQ3.1
NetC62_1: C62.1 XS1.13 XS1.14
NetC64_1: C64.1 R41.2 R42.2
NetC65_1: C65.1 R43.2 R44.2
NetC69_1: C69.1 R54.2 ZQ3.3
NetDD13_9: DD13.9(RSET_BG) R53.2
NetR47_1: R47.1 XS1.10
NetR50_1: R50.1 XS1.12
NetR51_2: R51.2 R53.1

Not connected (* = marked no-connect by the designer): DD13 18(SPDn) 19(DXPn) 21(COLn) 34(RDn) 35(WRn) 37(DAT0) 38(DAT1) 39(DAT2) 40(DAT3) 41(DAT4) 42(DAT5) 43(DAT6) 44(DAT7); XS1 7 8

### Layout directives
differential pair; differential pair class TD: TXO_N, TXO_P
differential pair; differential pair class RD: RXI_N, RXI_P
differential pair: RD_N, RD_P, TD_N, TD_P

### Notes on the sheet
- Как можно ближе к выводам 13, 22, 31, 45 DD17.
- Как можно ближе к выводу 4 DD17.
- Как можно ближе к выводам 8, 15 DD17.
- Подп. и дата
- Инв. № дубл.
- Взам. инв. №
- Инв. № подл.
- Изм.
- Лист
- № докум.
- Подп.
- Дата
- Копировал
- Формат А3
- (in symbol LPJD0012BENL) Цепь; Конт.; TD+; CT; TD-; RD+; RD-; NC; LED YELLOW +; LED YELLOW -; LED GREEN +; LED GREEN -; CASE

### Library data of the parts
C61 C63-C66 C68 C70-C77 = Capacitor: as C3 on sheet Main; Value: 0,1мкФ; Document: *
C62 = Capacitor: Manufacturer: Yageo; Model: CC1206KKX7RDBB102; Value: 1нФх2кВ; Document: *
C67 C69 = Capacitor: as C18 on sheet Main; Value: 8пФ; Document: *
DA13 = TPD4S009: Manufacturer: Texas Instruments; Model: TPD4S009DBVR; Document: *
DD13 = W5100S: Manufacturer: Wiznet; Model: W5100S-L; Document: *
L3-L5 = Inductor: Manufacturer: Murata; Value: *; Model: BLM21PG221SN1D; Document: *
R41-R44 = Resistor: Manufacturer: Yageo; Model: RC0603FR-0749R9L; Value: 49,9; Document: *
R45 R46 R48 R49 = Resistor: Manufacturer: Yageo; Model: RC0603FR-073R3L; Value: 3,3; Document: *
R47 R50 = Resistor: Manufacturer: Yageo; Model: RC0603FR-071KL; Value: 1к; Document: *
R51 = Resistor: Manufacturer: Yageo; Model: RC0603FR-07300RL; Value: 300; Document: *
R52 = Resistor: Manufacturer: Yageo; Model: RC0603FR-071ML; Value: 1М; Document: *
R53 = Resistor: Manufacturer: Yageo; Model: RC0603FR-0712KL; Value: 12к; Document: *
R54 = Resistor: Manufacturer: Yageo; Model: RC0603JR-070RL; Value: 0; Document: *
R55 = Resistor: as R3 on sheet Main; Value: 10к; Document: *
XS1 = LPJD0012BENL: Manufacturer: LINK-PP; Model: LPJD0012BENL; Document: *
ZQ3 = Quartz_Resonator_4-pin: Manufacturer: TXC; Model: 7M-25.000MAAJ-T; Value: 25МГц; Document: *

## Sheet Photodiode.SchDoc
size 420 x 297 mm; Address1: Address1; Address2: Address2; Address3: Address3; Address4: Address4; DocumentNumber: *Э3; SheetNumber: 2; SheetTotal: 11; DocumentType: Схема электрическая *
Used 2 times, as channels A1, A2. Parts and nets are listed once, with the designators drawn on the sheet.
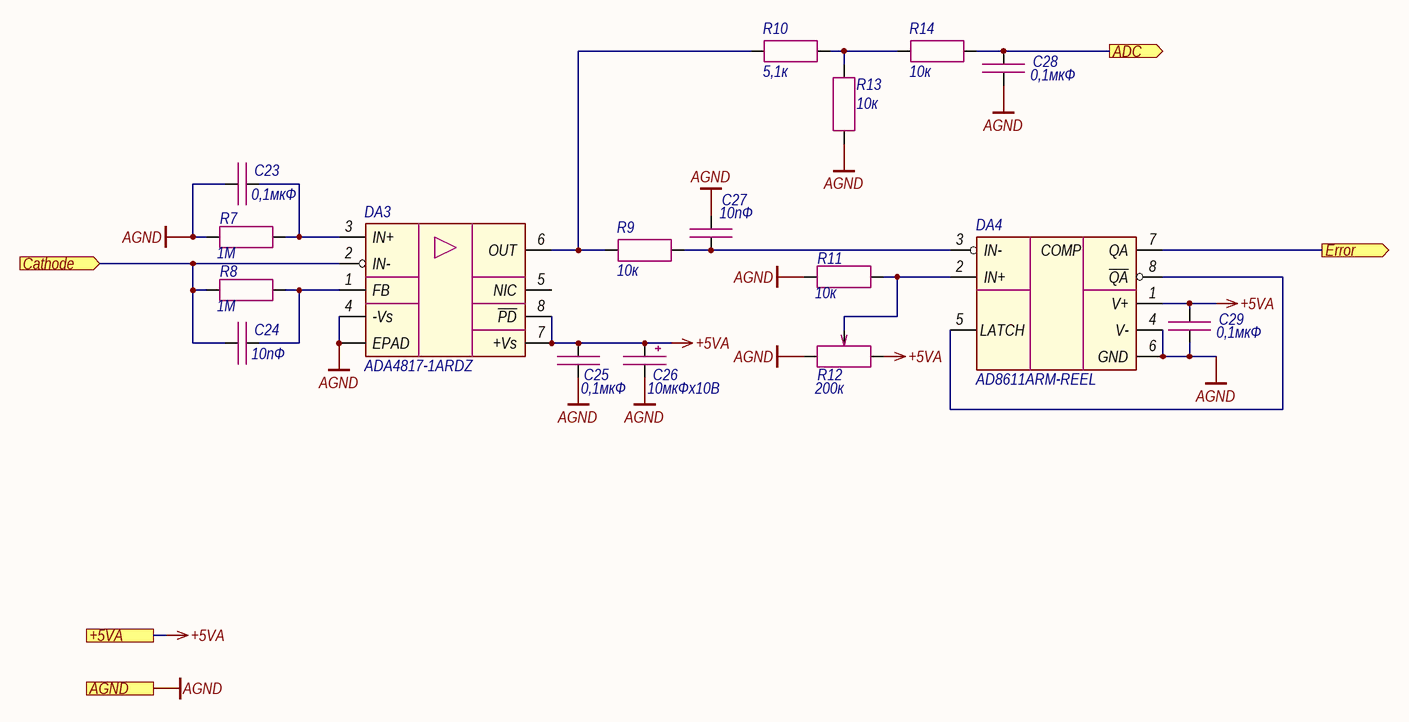
[diagram p4: Photodiode.SchDoc]

### Parts
C23  0,1мкФ  [CAP_0603]
C24  10пФ  [CAP_0603]
C25  0,1мкФ  [CAP_0603]
C26  10мкФх10B  [CAP_A]
C27  10пФ  [CAP_0603]
C28  0,1мкФ  [CAP_0603]
C29  0,1мкФ  [CAP_0603]
DA3  ADA4817-1ARDZ  [SOIC-8 EPAD]
DA4  AD8611ARM-REEL  [MSOP-8]
R7  1М  [RES_0805]
R8  1М  [RES_0805]
R9  10к  [RES_0603]
R10  5,1к  [RES_0603]
R11  10к  [RES_0603]
R12  200к  [3224W]
R13  10к  [RES_0603]
R14  10к  [RES_0603]

### Ports
+5VA (see Main[1A]), ADC (out, see Main[2A]), AGND (see Main[1A], Hardwiring[4D], LD_driver[2D], Thermistor[2C]), Cathode (in, see Main[1A]), Error (out, see Main[2A])

### Nets
+5VA: C25.1 C26.1 C29.1 DA3.7(+Vs) DA3.8(~{PD}) DA4.1(V+) R12.3 ; port +5VA
AGND: C23.1 C25.2 C26.2 C27.2 C28.2 C29.2 DA3.4(-Vs) DA3.EPAD DA4.4(V-) DA4.6(GND) R7.2 R11.1 R12.1 R13.2 ; port AGND
ADC: C28.1 R14.2 ; port ADC
Cathode: C24.2 DA3.2(IN-) R8.2 ; port Cathode
Error: DA4.7(QA) ; port Error
NetC23_2: C23.2 DA3.3(IN+) R7.1
NetC24_1: C24.1 DA3.1(FB) R8.1
NetC27_1: C27.1 DA4.3(IN-) R9.2
NetDA3_6: DA3.6(OUT) R9.1 R10.1
NetDA4_2: DA4.2(IN+) R11.2 R12.2
NetDA4_5: DA4.5(LATCH) DA4.8(~{QA})
NetR10_2: R10.2 R13.1 R14.1

Not connected (* = marked no-connect by the designer): DA3 5(NIC)

### Channels
A1: designators end in A1; ports +5VA=+5VA ADC=PD1_ADC AGND=AGND Cathode=PD1 Error=PD1_ERR
A2: designators end in A2; ports +5VA=+5VA ADC=PD2_ADC AGND=AGND Cathode=PD2 Error=PD2_ERR

### Notes on the sheet
- Подп. и дата
- Инв. № дубл.
- Взам. инв. №
- Инв. № подл.
- Изм.
- Лист
- № докум.
- Подп.
- Дата
- Копировал
- Формат А3
- (in symbol AD8611) COMP

### Library data of the parts
C23 C25 C28 C29 = Capacitor: as C3 on sheet Main; Value: 0,1мкФ; Document: *
C24 C27 = Capacitor: Manufacturer: Murata; Model: GRM1885C1H100JA01D; Value: 10пФ; Document: *
C26 = Capacitor_Polar: Model: TECAP, 10 мкФ, 10 В, тип A, 10%; Value: 10мкФх10B; Document: *; Manufacturer: *
DA3 = ADA4817-1ARDZ: Manufacturer: Analog Devices; Model: ADA4817-1ARDZ; Document: *
DA4 = AD8611: Manufacturer: Analog Devices; Model: AD8611ARM-REEL; Document: *
R7 R8 = Resistor: Manufacturer: Yageo; Model: RC0805FR-071ML; Value: 1М; Document: *
R9 R11 R13 R14 = Resistor: as R3 on sheet Main; Value: 10к; Document: *
R10 = Resistor: Manufacturer: Yageo; Model: RC0603FR-075K1L; Value: 5,1к; Document: *
R12 = Resistor_Variable: Manufacturer: Bourns; Model: 3224W-1-204E; Value: 200к; Document: *

## Sheet Thermistor.SchDoc
size 209 x 297 mm; Address1: Address1; Address2: Address2; Address3: Address3; Address4: Address4; DocumentNumber: *Э3; SheetNumber: 3; SheetTotal: 11; DocumentType: Схема электрическая *
Used 2 times, as channels A3, A4. Parts and nets are listed once, with the designators drawn on the sheet.
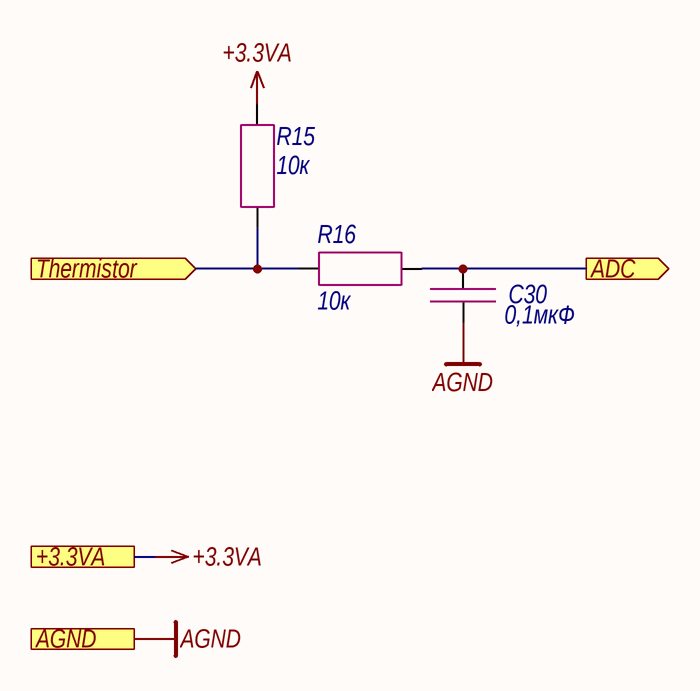
[diagram p5: Thermistor.SchDoc]

### Parts
C30  0,1мкФ  [CAP_0603]
R15  10к  [RES_0603]
R16  10к  [RES_0603]

### Ports
+3.3VA (see Main[1A], Hardwiring[4D], LD_driver[2D]), ADC (out, see Main[2A]), AGND (see Main[1B], Hardwiring[4D], LD_driver[2D], Photodiode[1C]), Thermistor (in, see Main[1A])

### Nets
+3.3VA: R15.1 ; port +3.3VA
AGND: C30.2 ; port AGND
ADC: C30.1 R16.2 ; port ADC
Thermistor: R15.2 R16.1 ; port Thermistor

### Channels
A3: designators end in A3; ports +3.3VA=+3.3VA ADC=T1_ADC AGND=AGND Thermistor=T1
A4: designators end in A4; ports +3.3VA=+3.3VA ADC=T2_ADC AGND=AGND Thermistor=T2

### Notes on the sheet
- Подп. и дата
- Инв. № дубл.
- Взам. инв. №
- Инв. № подл.
- Изм.
- Лист
- № докум.
- Подп.
- Дата
- Копировал
- Формат А4

### Library data of the parts
C30 = Capacitor: as C3 on sheet Main; Value: 0,1мкФ; Document: *
R15 R16 = Resistor: as R3 on sheet Main; Value: 10к; Document: *

## Sheet Power_supply.SchDoc
size 420 x 297 mm; Address1: Address1; Address2: Address2; Address3: Address3; Address4: Address4; DocumentNumber: *Э3; SheetNumber: 4; SheetTotal: 11; DocumentType: Схема электрическая *
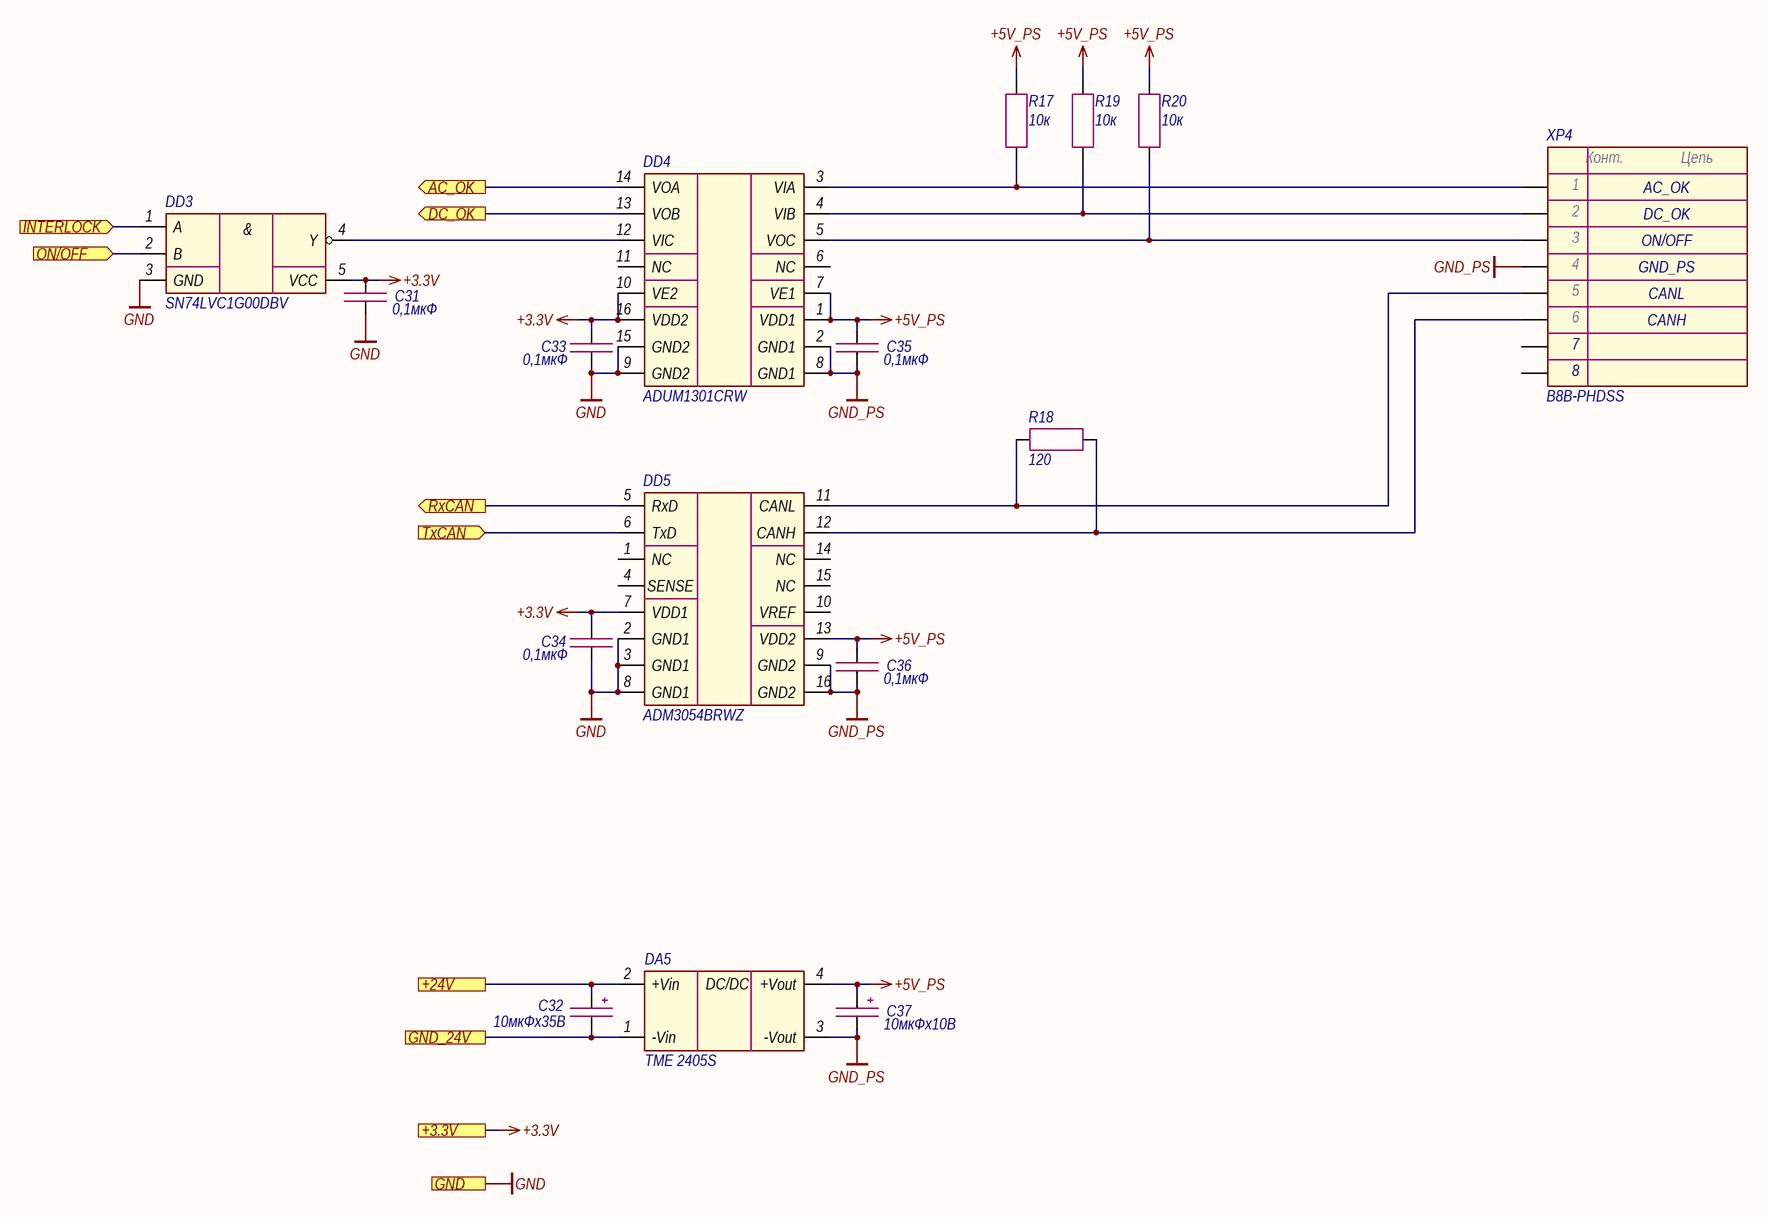
[diagram p6: Power_supply.SchDoc]

### Parts
C31  0,1мкФ  [CAP_0603]
C32  10мкФх35B  [CAP_C]
C33  0,1мкФ  [CAP_0603]
C34  0,1мкФ  [CAP_0603]
C35  0,1мкФ  [CAP_0603]
C36  0,1мкФ  [CAP_0603]
C37  10мкФх10B  [CAP_A]
DA5  TME 2405S  [TME (SIP-4)]
DD3  SN74LVC1G00DBV  [SOT-23-5]
DD4  ADUM1301CRW  [SOIC-16W]
DD5  ADM3054BRWZ  [SOIC-16W]
R17  10к  [RES_0603]
R18  120  [RES_0805]
R19  10к  [RES_0603]
R20  10к  [RES_0603]
XP4  B8B-PHDSS  [B8B-PHDSS]

### Ports
+3.3V (see Main[1B], Ethernet[3D], Fiber_interlock[2C], Hardwiring[3D], LD_driver[1D], Protection[2C]), +24V (see Main[1B], Hardwiring[3C], Indication[1C], LD_driver[1D]), AC_OK (out, see Main[2B]), DC_OK (out, see Main[2B]), GND (see Main[1B], Ethernet[3D], Fiber_interlock[2C], Guide_laser[1C], Hardwiring[3D], Indication[1C], LD_driver[1D], Protection[2C]), GND_24V (see Main[1B], Hardwiring[3C], Indication[1C], LD_driver[1D]), INTERLOCK (in, see Main[1B], LD_driver[1A], Protection[4B]), ON/OFF (in, see Main[1B]), RxCAN (out, see Main[2B]), TxCAN (in, see Main[2B])

### Nets
+3.3V: C31.1 C33.1 C34.1 DD3.5(VCC) DD4.10(VE2) DD4.16(VDD2) DD5.7(VDD1) ; port +3.3V
+5V_PS: C35.1 C36.1 C37.1 DA5.4(+Vout) DD4.1(VDD1) DD4.7(VE1) DD5.13(VDD2) R17.1 R19.1 R20.1
+24V: C32.1 DA5.2(+Vin) ; port +24V
GND: C31.2 C33.2 C34.2 DD3.3(GND) DD4.9(GND2) DD4.15(GND2) DD5.2(GND1) DD5.3(GND1) DD5.8(GND1) ; port GND
GND_24V: C32.2 DA5.1(-Vin) ; port GND_24V
GND_PS: C35.2 C36.2 C37.2 DA5.3(-Vout) DD4.2(GND1) DD4.8(GND1) DD5.9(GND2) DD5.16(GND2) XP4.4
INT_IL: DD3.1(A) ; port INTERLOCK
PS_ERR1: DD4.14(VOA) ; port AC_OK
PS_ERR2: DD4.13(VOB) ; port DC_OK
PS_ON: DD3.2(B) ; port ON/OFF
RxCAN: DD5.5(RxD) ; port RxCAN
TxCAN: DD5.6(TxD) ; port TxCAN
NetDD3_4: DD3.4(Y) DD4.12(VIC)
NetDD4_3: DD4.3(VIA) R17.2 XP4.1
NetDD4_4: DD4.4(VIB) R19.2 XP4.2
NetDD4_5: DD4.5(VOC) R20.2 XP4.3
NetDD5_11: DD5.11(CANL) R18.1 XP4.5
NetDD5_12: DD5.12(CANH) R18.2 XP4.6

Not connected (* = marked no-connect by the designer): DD4 6(NC) 11(NC); DD5 1(NC) 4(SENSE) 10(VREF) 14(NC) 15(NC); XP4 7 8

### Notes on the sheet
- AC_OK
- DC_OK
- ON/OFF
- GND_PS
- CANH
- CANL
- Подп. и дата
- Инв. № дубл.
- Взам. инв. №
- Инв. № подл.
- Изм.
- Лист
- № докум.
- Подп.
- Дата
- Копировал
- Формат А3
- (in symbol Connector-8) Конт.; Цепь
- (in symbol SN74LVC1G00) &
- (in symbol TME) DC/DC

### Library data of the parts
C31 C33-C36 = Capacitor: as C3 on sheet Main; Value: 0,1мкФ; Document: *
C32 = Capacitor_Polar: Model: TECAP, 10 мкФ, 35 В, тип C, 10%; Value: 10мкФх35B; Document: *; Manufacturer: *
C37 = Capacitor_Polar: Model: TECAP, 10 мкФ, 10 В, тип A, 10%; Value: 10мкФх10B; Document: *; Manufacturer: *
DA5 = TME: Manufacturer: Traco Power; Model: TME 2405S; Document: *
DD3 = SN74LVC1G00: Manufacturer: Texas Instruments; Model: SN74LVC1G00DBV; Document: *
DD4 = ADUM1301: Manufacturer: Analog Devices; Model: ADUM1301CRW; Document: *
DD5 = ADM3054BRWZ: Manufacturer: Analog Devices; Model: ADM3054BRWZ; Document: *
R17 R19 R20 = Resistor: as R3 on sheet Main; Value: 10к; Document: *
R18 = Resistor: Manufacturer: Yageo; Model: RC0805FR-07120RL; Value: 120; Document: *
XP4 = Connector-8: Manufacturer: JST; Model: B8B-PHDSS; Document: *

## Sheet LD_driver.SchDoc
size 420 x 297 mm; Address1: Address1; Address2: Address2; Address3: Address3; Address4: Address4; DocumentNumber: *Э3; SheetNumber: 5; SheetTotal: 11; DocumentType: Схема электрическая *
Used 2 times, as channels A6, A7. Parts and nets are listed once, with the designators drawn on the sheet.
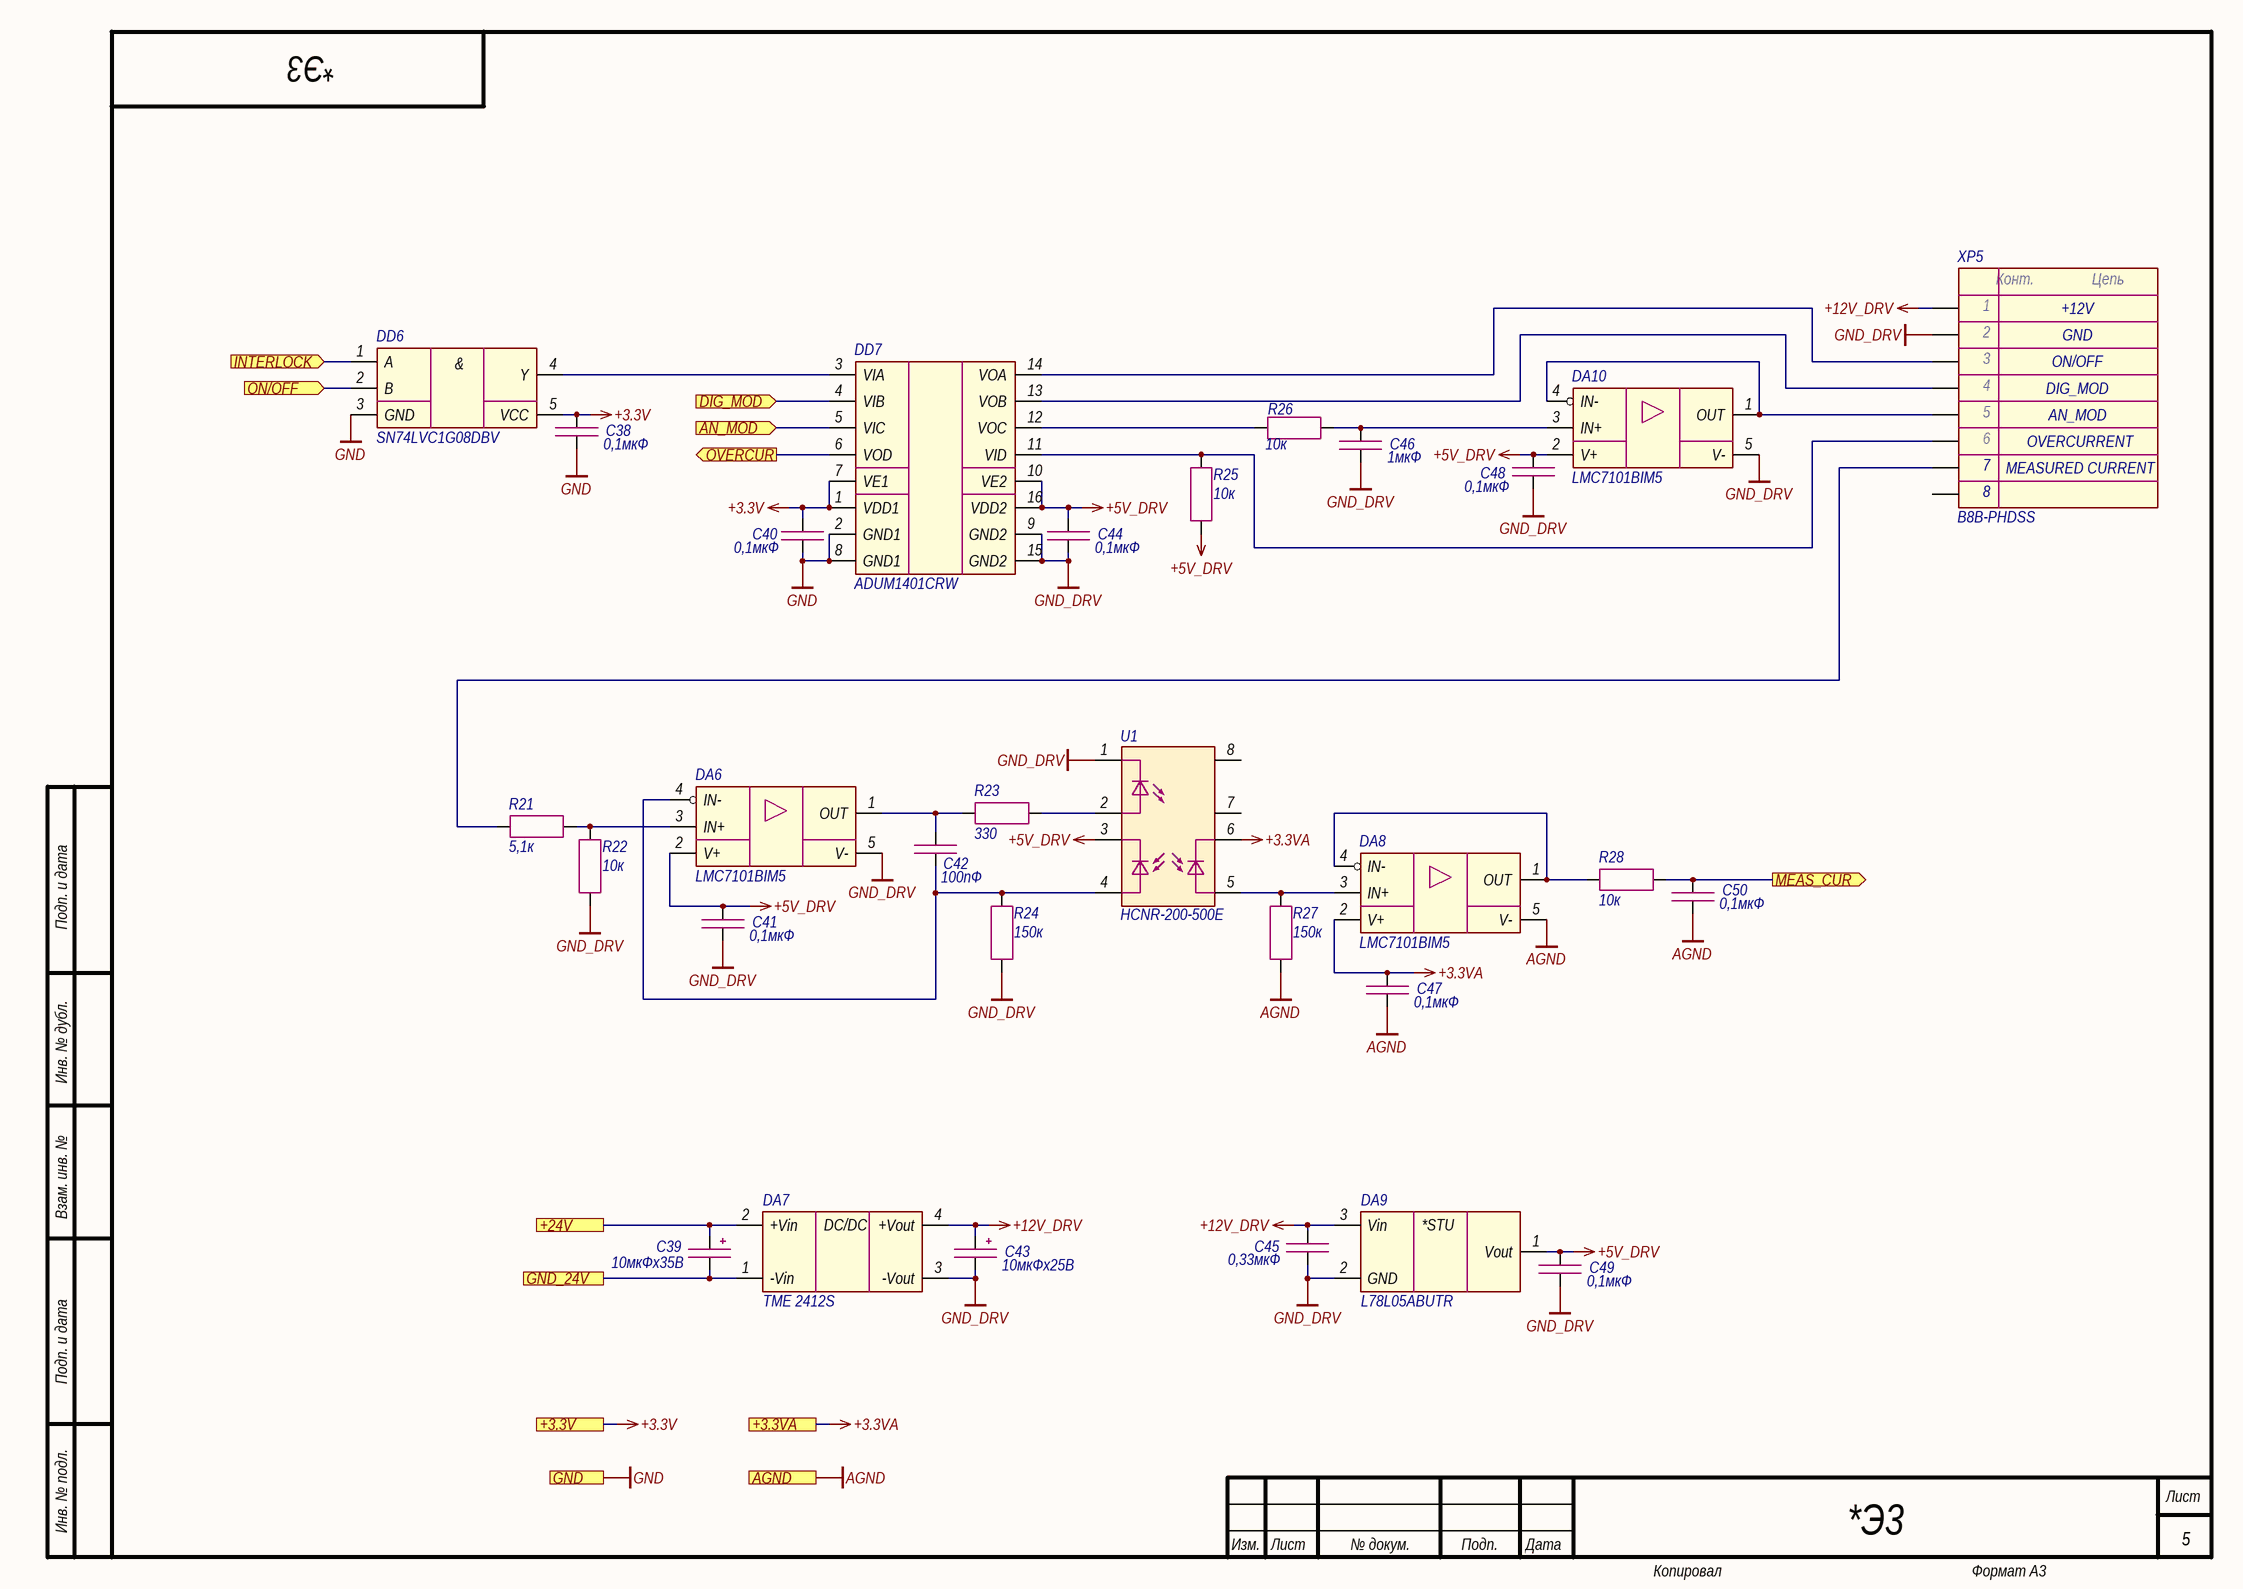
[diagram p7: LD_driver.SchDoc]

### Parts
C38  0,1мкФ  [CAP_0603]
C39  10мкФх35B  [CAP_C]
C40  0,1мкФ  [CAP_0603]
C41  0,1мкФ  [CAP_0603]
C42  100пФ  [CAP_0603]
C43  10мкФх25B  [CAP_B]
C44  0,1мкФ  [CAP_0603]
C45  0,33мкФ  [CAP_0805]
C46  1мкФ  [CAP_0603]
C47  0,1мкФ  [CAP_0603]
C48  0,1мкФ  [CAP_0603]
C49  0,1мкФ  [CAP_0603]
C50  0,1мкФ  [CAP_0603]
DA6  LMC7101BIM5  [SOT-23-5]
DA7  TME 2412S  [TME (SIP-4)]
DA8  LMC7101BIM5  [SOT-23-5]
DA9  L78L05ABUTR  [SOT-89]
DA10  LMC7101BIM5  [SOT-23-5]
DD6  SN74LVC1G08DBV  [SOT-23-5]
DD7  ADUM1401CRW  [SOIC-16W]
R21  5,1к  [RES_0603]
R22  10к  [RES_0603]
R23  330  [RES_0603]
R24  150к  [RES_0603]
R25  10к  [RES_0603]
R26  10к  [RES_0603]
R27  150к  [RES_0603]
R28  10к  [RES_0603]
U1  HCNR-200-500E  [HCNR200]
XP5  B8B-PHDSS  [B8B-PHDSS]

### Ports
+3.3V (see Main[2C], Ethernet[3D], Fiber_interlock[2C], Hardwiring[3D], Power_supply[2D], Protection[2C]), +3.3VA (see Main[2C], Hardwiring[4D], Thermistor[2C]), +24V (see Main[1C], Hardwiring[3C], Indication[1C], Power_supply[2C]), AGND (see Main[2C], Hardwiring[4D], Photodiode[1C], Thermistor[2C]), AN_MOD (in, see Main[1C]), DIG_MOD (in, see Main[1C]), GND (see Main[2C], Ethernet[3D], Fiber_interlock[2C], Guide_laser[1C], Hardwiring[3D], Indication[1C], Power_supply[2D], Protection[2C]), GND_24V (see Main[1C], Hardwiring[3C], Indication[1C], Power_supply[2C]), INTERLOCK (in, see Main[1B], Power_supply[1A], Protection[4B]), MEAS_CUR (out, see Main[2B]), ON/OFF (in, see Main[1B]), OVERCUR (out, see Main[2B])

### Nets
+3.3V: C38.1 C40.1 DD6.5(VCC) DD7.1(VDD1) DD7.7(VE1) ; port +3.3V
+3.3VA: C47.1 DA8.2(V+) U1.6 ; port +3.3VA
+5V_DRV: C41.1 C44.1 C48.1 C49.1 DA6.2(V+) DA9.1(Vout) DA10.2(V+) DD7.10(VE2) DD7.16(VDD2) R25.2 U1.3
+12V_DRV: C43.1 C45.2 DA7.4(+Vout) DA9.3(Vin) XP5.1
AGND: C47.2 C50.2 DA8.5(V-) R27.2 ; port AGND
GND: C38.2 C40.2 DD6.3(GND) DD7.2(GND1) DD7.8(GND1) ; port GND
GND_DRV: C41.2 C43.2 C44.2 C45.1 C46.2 C48.2 C49.2 DA6.5(V-) DA7.3(-Vout) DA9.2(GND) DA10.5(V-) DD7.9(GND2) DD7.15(GND2) R22.2 R24.2 U1.1 XP5.2
+24V: C39.1 DA7.2(+Vin) ; port +24V
AN_MOD: DD7.5(VIC) ; port AN_MOD
DIG_MOD: DD7.4(VIB) ; port DIG_MOD
GND_24V: C39.2 DA7.1(-Vin) ; port GND_24V
INTERLOCK: DD6.1(A) ; port INTERLOCK
MEAS_CUR: C50.1 R28.2 ; port MEAS_CUR
ON/OFF: DD6.2(B) ; port ON/OFF
OVERCUR: DD7.6(VOD) ; port OVERCUR
NetC42_1: C42.1 DA6.1(OUT) R23.1
NetC42_2: C42.2 DA6.4(IN-) R24.1 U1.4
NetC46_1: C46.1 DA10.3(IN+) R26.2
NetDA6_3: DA6.3(IN+) R21.2 R22.1
NetDA8_1: DA8.1(OUT) DA8.4(IN-) R28.1
NetDA8_3: DA8.3(IN+) R27.1 U1.5
NetDA10_1: DA10.1(OUT) DA10.4(IN-) XP5.5
NetDD6_4: DD6.4(Y) DD7.3(VIA)
NetDD7_11: DD7.11(VID) R25.1 XP5.6
NetDD7_12: DD7.12(VOC) R26.1
NetDD7_13: DD7.13(VOB) XP5.4
NetDD7_14: DD7.14(VOA) XP5.3
NetR21_1: R21.1 XP5.7
NetR23_2: R23.2 U1.2

Not connected (* = marked no-connect by the designer): U1 7 8; XP5 8

### Channels
A6: designators end in A6; ports +3.3V=+3.3V +3.3VA=+3.3VA +24V=+24V AGND=AGND AN_MOD=DRV1_AN_MOD DIG_MOD=DRV1_DIG_MOD GND=GND GND_24V=GND_24V INTERLOCK=INT_IL MEAS_CUR=DRV1_ADC ON/OFF=DRV1_ON OVERCUR=DRV1_ERR
A7: designators end in A7; ports +3.3V=+3.3V +3.3VA=+3.3VA +24V=+24V AGND=AGND AN_MOD=DRV2_AN_MOD DIG_MOD=DRV2_DIG_MOD GND=GND GND_24V=GND_24V INTERLOCK=INT_IL MEAS_CUR=DRV2_ADC ON/OFF=DRV2_ON OVERCUR=DRV2_ERR

### Notes on the sheet
- +12V
- GND
- ON/OFF
- DIG_MOD
- AN_MOD
- OVERCURRENT
- MEASURED CURRENT
- Подп. и дата
- Инв. № дубл.
- Взам. инв. №
- Инв. № подл.
- Изм.
- Лист
- № докум.
- Подп.
- Дата
- Копировал
- Формат А3
- (in symbol Connector-8) Конт.; Цепь
- (in symbol LD2981ABU50TR) *STU
- (in symbol SN74LVC1G08) &
- (in symbol TME) DC/DC

### Library data of the parts
C38 C40 C41 C44 C47-C50 = Capacitor: as C3 on sheet Main; Value: 0,1мкФ; Document: *
C39 = Capacitor_Polar: Model: TECAP, 10 мкФ, 35 В, тип C, 10%; Value: 10мкФх35B; Document: *; Manufacturer: *
C42 = Capacitor: as C82 on sheet Hardwiring; Value: 100пФ; Document: *
C43 = Capacitor_Polar: Model: TECAP, 10 мкФ, 25 В, тип B, 10%; Value: 10мкФх25B; Document: *; Manufacturer: *
C45 = Capacitor: as C91 on sheet Hardwiring; Value: 0,33мкФ; Document: *
C46 = Capacitor: as C95 on sheet Hardwiring; Value: 1мкФ; Document: *
DA6 DA8 DA10 = LMC7101: Manufacturer: Texas Instruments; Model: LMC7101BIM5; Document: *
DA7 = TME: Manufacturer: Traco Power; Model: TME 2412S; Document: *
DA9 = LD2981ABU50TR: Manufacturer: STMicroelectronics; Model: L78L05ABUTR; Document: *
DD6 = SN74LVC1G08: Manufacturer: Texas Instruments; Model: SN74LVC1G08DBV; Document: *
DD7 = ADUM1401: Manufacturer: Analog Devices; Model: ADUM1401CRW; Document: *
R21 = Resistor: as R10 on sheet Photodiode; Value: 5,1к; Document: *
R22 R25 R26 R28 = Resistor: as R3 on sheet Main; Value: 10к; Document: *
R23 = Resistor: as R75 on sheet Hardwiring; Value: 330; Document: *
R24 R27 = Resistor: as R77 on sheet Hardwiring; Value: 150к; Document: *
U1 = HCNR200: Manufacturer: Avago; Model: HCNR-200-500E; Document: *
XP5 = Connector-8: Manufacturer: JST; Model: B8B-PHDSS; Document: *

## Sheet Protection.SchDoc
size 420 x 297 mm; Address1: Address1; Address2: Address2; Address3: Address3; Address4: Address4; DocumentNumber: *Э3; SheetNumber: 9; SheetTotal: 11; DocumentType: Схема электрическая *
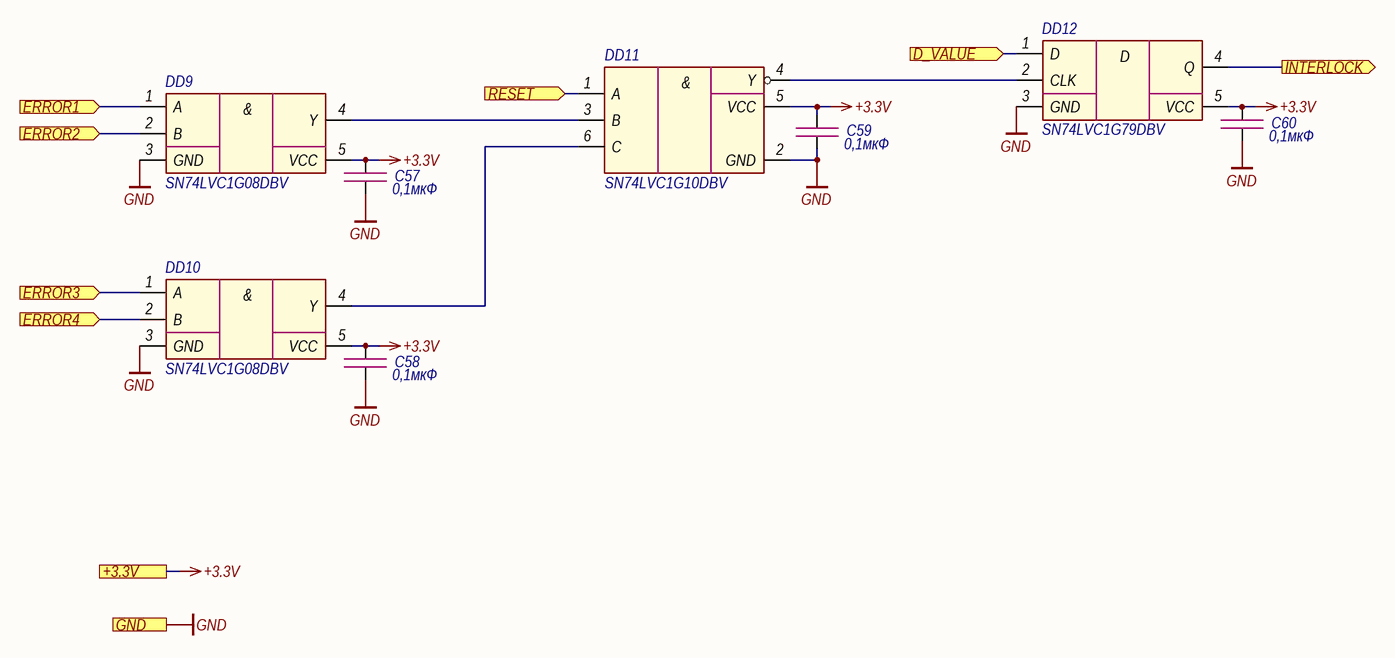
[diagram p8: Protection.SchDoc]

### Parts
C57  0,1мкФ  [CAP_0603]
C58  0,1мкФ  [CAP_0603]
C59  0,1мкФ  [CAP_0603]
C60  0,1мкФ  [CAP_0603]
DD9  SN74LVC1G08DBV  [SOT-23-5]
DD10  SN74LVC1G08DBV  [SOT-23-5]
DD11  SN74LVC1G10DBV  [SOT-23-6]
DD12  SN74LVC1G79DBV  [SOT-23-5]

### Ports
+3.3V (see Main[2B], Ethernet[3D], Fiber_interlock[2C], Hardwiring[3D], LD_driver[1D], Power_supply[2D]), D_VALUE (in, see Main[2B]), ERROR1 (in, see Main[2B]), ERROR2 (in, see Main[2B]), ERROR3 (in, see Main[2B]), ERROR4 (in, see Main[2B]), GND (see Main[2B], Ethernet[3D], Fiber_interlock[2C], Guide_laser[1C], Hardwiring[3D], Indication[1C], LD_driver[1D], Power_supply[2D]), INTERLOCK (out, see Main[2B], LD_driver[1A], Power_supply[1A]), RESET (in, see Main[2B])

### Nets
+3.3V: C57.1 C58.1 C59.1 C60.1 DD9.5(VCC) DD10.5(VCC) DD11.5(VCC) DD12.5(VCC) ; port +3.3V
GND: C57.2 C58.2 C59.2 C60.2 DD9.3(GND) DD10.3(GND) DD11.2(GND) DD12.3(GND) ; port GND
D_VALUE: DD12.1(D) ; port D_VALUE
DRV1_ERR: DD10.1(A) ; port ERROR3
DRV2_ERR: DD10.2(B) ; port ERROR4
ERR_RESET: DD11.1(A) ; port RESET
INT_IL: DD12.4(Q) ; port INTERLOCK
PD1_ERR: DD9.1(A) ; port ERROR1
PD2_ERR: DD9.2(B) ; port ERROR2
NetDD9_4: DD9.4(Y) DD11.3(B)
NetDD10_4: DD10.4(Y) DD11.6(C)
NetDD11_4: DD11.4(Y) DD12.2(CLK)

### Notes on the sheet
- Подп. и дата
- Инв. № дубл.
- Взам. инв. №
- Инв. № подл.
- Изм.
- Лист
- № докум.
- Подп.
- Дата
- Копировал
- Формат А3
- (in symbol SN74LVC1G08) &
- (in symbol SN74LVC1G10) &

### Library data of the parts
C57-C60 = Capacitor: as C3 on sheet Main; Value: 0,1мкФ; Document: *
DD9 DD10 = SN74LVC1G08: Manufacturer: Texas Instruments; Model: SN74LVC1G08DBV; Document: *
DD11 = SN74LVC1G10: Manufacturer: Texas Instruments; Model: SN74LVC1G10DBV; Document: *
DD12 = SN74LVC1G79: Manufacturer: Texas Instruments; Model: SN74LVC1G79DBV; Document: *

## Sheet Guide_laser.SchDoc
size 420 x 297 mm; Address1: Address1; Address2: Address2; Address3: Address3; Address4: Address4; DocumentNumber: *Э3; SheetNumber: 6; SheetTotal: 11; DocumentType: Схема электрическая *
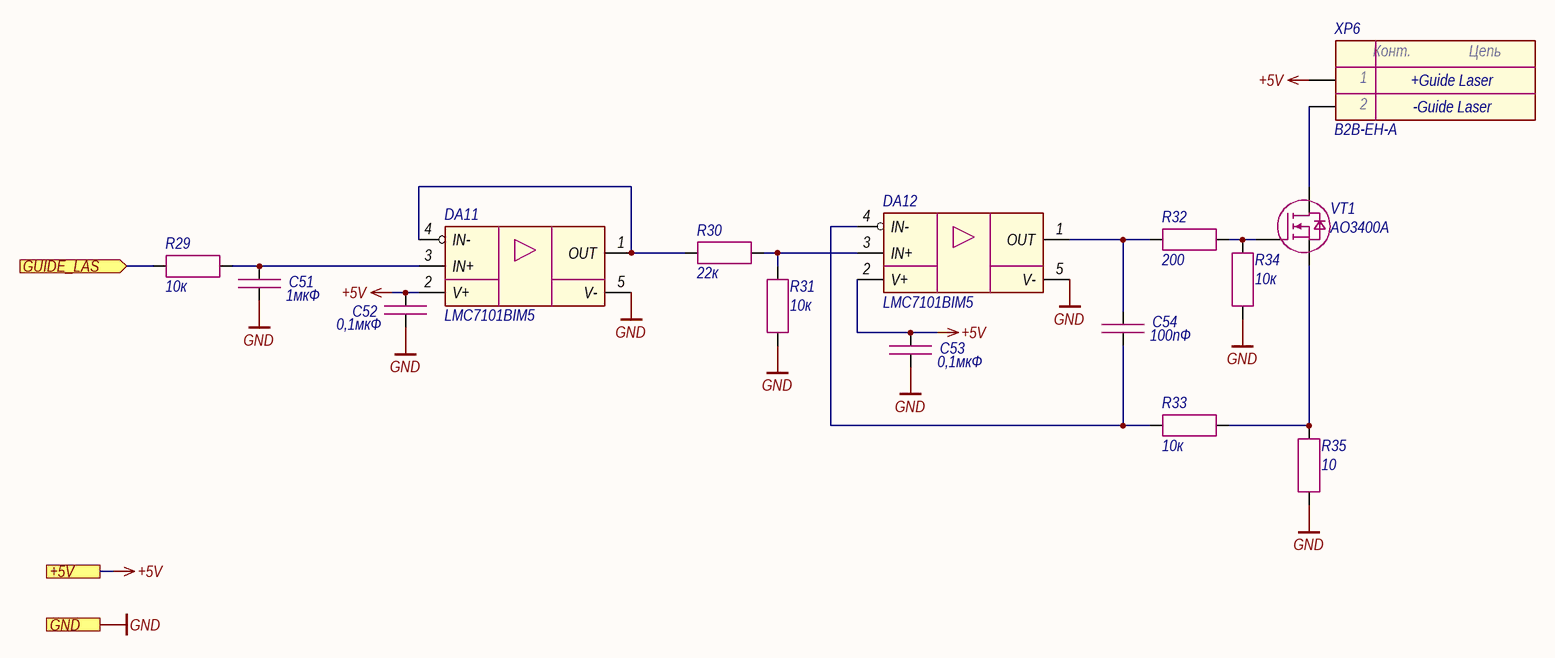
[diagram p9: Guide_laser.SchDoc]

### Parts
C51  1мкФ  [CAP_0603]
C52  0,1мкФ  [CAP_0603]
C53  0,1мкФ  [CAP_0603]
C54  100пФ  [CAP_0603]
DA11  LMC7101BIM5  [SOT-23-5]
DA12  LMC7101BIM5  [SOT-23-5]
R29  10к  [RES_0603]
R30  22к  [RES_0603]
R31  10к  [RES_0603]
R32  200  [RES_0603]
R33  10к  [RES_0603]
R34  10к  [RES_0603]
R35  10  [RES_1210]
VT1  AO3400A  [SOT-23-3]
XP6  B2B-EH-A  [B2B-EH-A]

### Ports
+5V (see Main[2A]), GND (see Main[2A], Ethernet[3D], Fiber_interlock[2C], Hardwiring[3D], Indication[1C], LD_driver[1D], Power_supply[2D], Protection[2C]), GUIDE_LAS (in, see Main[2A])

### Nets
+5V: C52.1 C53.1 DA11.2(V+) DA12.2(V+) XP6.1 ; port +5V
GND: C51.2 C52.2 C53.2 DA11.5(V-) DA12.5(V-) R31.2 R34.1 R35.1 ; port GND
GUIDE_LAS: R29.1 ; port GUIDE_LAS
NetC51_1: C51.1 DA11.3(IN+) R29.2
NetC54_1: C54.1 DA12.1(OUT) R32.1
NetC54_2: C54.2 DA12.4(IN-) R33.1
NetDA11_1: DA11.1(OUT) DA11.4(IN-) R30.1
NetDA12_3: DA12.3(IN+) R30.2 R31.1
NetR32_2: R32.2 R34.2 VT1.1(G)
NetR33_2: R33.2 R35.2 VT1.2(S)
NetVT1_3: VT1.3(D) XP6.2

### Notes on the sheet
- +Guide Laser
- -Guide Laser
- Подп. и дата
- Инв. № дубл.
- Взам. инв. №
- Инв. № подл.
- Изм.
- Лист
- № докум.
- Подп.
- Дата
- Копировал
- Формат А3
- (in symbol Connector-2) Конт.; Цепь

### Library data of the parts
C51 = Capacitor: as C95 on sheet Hardwiring; Value: 1мкФ; Document: *
C52 C53 = Capacitor: as C3 on sheet Main; Value: 0,1мкФ; Document: *
C54 = Capacitor: as C82 on sheet Hardwiring; Value: 100пФ; Document: *
DA11 DA12 = LMC7101: Manufacturer: Texas Instruments; Model: LMC7101BIM5; Document: *
R29 R31 R33 R34 = Resistor: as R3 on sheet Main; Value: 10к; Document: *
R30 = Resistor: Manufacturer: Yageo; Model: RC0603FR-0722KL; Value: 22к; Document: *
R32 = Resistor: as R5 on sheet Main; Value: 200; Document: *
R35 = Resistor: Manufacturer: Yageo; Model: RC1210FR-0710RL; Value: 10; Document: *
VT1 = MOSFET N-channel: Manufacturer: UMW; Model: AO3400A; Document: *
XP6 = Connector-2: Manufacturer: JST; Model: B2B-EH-A; Document: *

## Sheet Fiber_interlock.SchDoc
size 420 x 297 mm; Address1: Address1; Address2: Address2; Address3: Address3; Address4: Address4; DocumentNumber: *Э3; SheetNumber: 8; SheetTotal: 11; DocumentType: Схема электрическая *
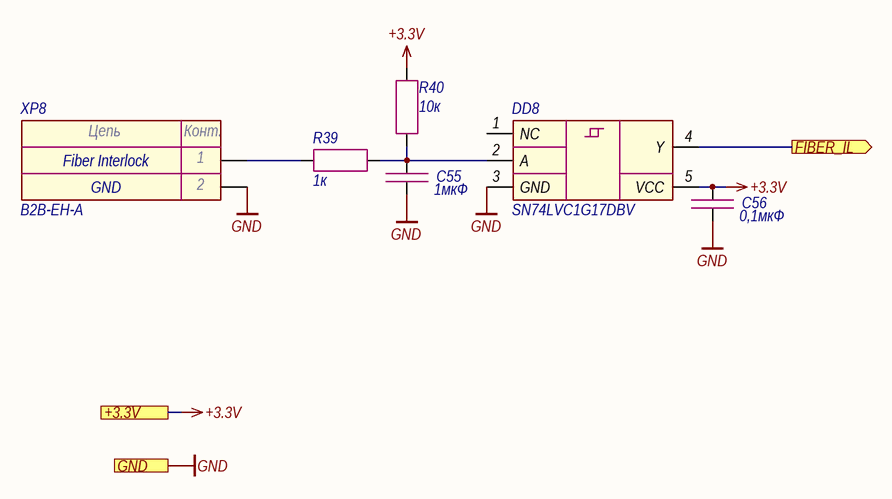
[diagram p10: Fiber_interlock.SchDoc]

### Parts
C55  1мкФ  [CAP_0603]
C56  0,1мкФ  [CAP_0603]
DD8  SN74LVC1G17DBV  [SOT-23-5]
R39  1к  [RES_0603]
R40  10к  [RES_0603]
XP8  B2B-EH-A  [B2B-EH-A]

### Ports
+3.3V (see Main[2A], Ethernet[3D], Hardwiring[3D], LD_driver[1D], Power_supply[2D], Protection[2C]), FIBER_IL (out, see Main[2A]), GND (see Main[2A], Ethernet[3D], Guide_laser[1C], Hardwiring[3D], Indication[1C], LD_driver[1D], Power_supply[2D], Protection[2C])

### Nets
+3.3V: C56.1 DD8.5(VCC) R40.2 ; port +3.3V
GND: C55.2 C56.2 DD8.3(GND) XP8.2 ; port GND
FIBER_IL: DD8.4(Y) ; port FIBER_IL
NetC55_1: C55.1 DD8.2(A) R39.2 R40.1
NetR39_1: R39.1 XP8.1

Not connected (* = marked no-connect by the designer): DD8 1(NC)

### Notes on the sheet
- (near XP8) Fiber Interlock
- GND
- Подп. и дата
- Инв. № дубл.
- Взам. инв. №
- Инв. № подл.
- Изм.
- Лист
- № докум.
- Подп.
- Дата
- Копировал
- Формат А3
- (in symbol Connector-2) Цепь; Конт.

### Library data of the parts
C55 = Capacitor: as C95 on sheet Hardwiring; Value: 1мкФ; Document: *
C56 = Capacitor: as C3 on sheet Main; Value: 0,1мкФ; Document: *
DD8 = SN74LVC1G17: Manufacturer: Texas Instruments; Model: SN74LVC1G17DBV; Document: *
R39 = Resistor: as R47 on sheet Ethernet; Value: 1к; Document: *
R40 = Resistor: as R3 on sheet Main; Value: 10к; Document: *
XP8 = Connector-2: Manufacturer: JST; Model: B2B-EH-A; Document: *

## Nets that join several sheets
+3.3V: Main (20 pins), Hardwiring (12 pins), Ethernet (10 pins), Power_supply (7 pins), A6 (5 pins), Protection (8 pins), A7 (5 pins), Fiber_interlock (C56.1 DD8.5 R40.2)
+3.3VA: Main (6 pins), Hardwiring (C87.1 DA15.2 U6.6), A3 (R15A3.1), A6 (C47A6.1 DA8A6.2 U1A6.6), A4 (R15A4.1), A7 (C47A7.1 DA8A7.2 U1A7.6)
+5V: Main (5 pins), Guide_laser (5 pins)
+5VA: Main (C3.1 L1.2), A1 (7 pins), A2 (7 pins)
+24V: Main (C1.1 DA1.2 XP2.1), Indication (XP7.1 XP7.3 XP7.5), Hardwiring (C90.1 DA16.2), Power_supply (C32.1 DA5.2), A6 (C39A6.1 DA7A6.2), A7 (C39A7.1 DA7A7.2)
AGND: Main (11 pins), Hardwiring (C87.2 C88.2 DA15.5 R81.2), A1 (14 pins), A3 (C30A3.2), A6 (C47A6.2 C50A6.2 DA8A6.5 R27A6.2), A2 (14 pins), A4 (C30A4.2), A7 (C47A7.2 C50A7.2 DA8A7.5 R27A7.2)
GND: Main (38 pins), Indication (U2.2 U3.2 U4.2), Hardwiring (15 pins), Ethernet (31 pins), Power_supply (9 pins), A6 (5 pins), Protection (8 pins), Guide_laser (8 pins), A7 (5 pins), Fiber_interlock (C55.2 C56.2 DD8.3 XP8.2)
GND_24V: Main (C1.2 DA1.1 XP2.2), Indication (U2.3 U3.3 U4.3), Hardwiring (C90.2 DA16.1), Power_supply (C32.2 DA5.1), A6 (C39A6.2 DA7A6.1), A7 (C39A7.2 DA7A7.1)
CRASH_IND: Main (DD1.3), Indication (R38.2)
D_VALUE: Main (DD1.52), Protection (DD12.1)
DRV1_ADC: Main (DD1.29), A6 (C50A6.1 R28A6.2)
DRV1_AN_MOD: Main (DD1.63), A6 (DD7A6.5)
DRV1_DIG_MOD: Main (DD1.59), A6 (DD7A6.4)
DRV1_ERR: Main (DD1.61), A6 (DD7A6.6), Protection (DD10.1)
DRV1_ON: Main (DD1.58), A6 (DD6A6.2)
DRV2_ADC: Main (DD1.30), A7 (C50A7.1 R28A7.2)
DRV2_AN_MOD: Main (DD1.64), A7 (DD7A7.5)
DRV2_DIG_MOD: Main (DD1.60), A7 (DD7A7.4)
DRV2_ERR: Main (DD1.65), Protection (DD10.2), A7 (DD7A7.6)
DRV2_ON: Main (DD1.62), A7 (DD6A7.2)
EMIS_IND: Main (DD1.2), Indication (R37.2)
ERR_RESET: Main (DD1.53), Protection (DD11.1)
ETH_CS: Main (DD1.92), Ethernet (DD13.29)
ETH_INT: Main (DD1.95), Ethernet (DD13.47)
ETH_MISO: Main (DD1.90), Ethernet (DD13.33)
ETH_MOSI: Main (DD1.91), Ethernet (DD13.32)
ETH_RST: Main (DD1.93), Ethernet (DD13.48 R55.1)
ETH_SCLK: Main (DD1.89), Ethernet (DD13.30)
EXT_AN_MOD: Main (DD1.31), Hardwiring (C88.1 R82.2)
EXT_COM1: Main (DD1.38), Hardwiring (DD16.13)
EXT_COM2: Main (DD1.39), Hardwiring (DD16.12)
EXT_COM3: Main (DD1.40), Hardwiring (DD16.11)
EXT_DIG_MOD: Main (DD1.36), Hardwiring (DD16.14)
EXT_FLAG1: Main (DD1.41), Hardwiring (R83.2)
EXT_FLAG2: Main (DD1.42), Hardwiring (R84.2)
EXT_FLAG3: Main (DD1.43), Hardwiring (R85.2)
EXT_FLAG4: Main (DD1.44), Hardwiring (R86.2)
EXT_IL1: Main (DD1.32), Hardwiring (R76.2 U5.16)
EXT_IL2: Main (DD1.33), Hardwiring (R78.2 U5.14)
EXT_KEY: Main (DD1.34), Hardwiring (R79.2 U5.12)
EXT_MP_EN: Main (DD1.35), Hardwiring (R80.2 U5.10)
EXT_PMO: Main (DD1.45), Hardwiring (DD17.2)
FIBER_IL: Main (DD1.5), Fiber_interlock (DD8.4)
GUIDE_LAS: Main (DD1.4), Guide_laser (R29.1)
INT_IL: Main (DD1.51), Power_supply (DD3.1), A6 (DD6A6.1), Protection (DD12.4), A7 (DD6A7.1)
PD1: Main (XP1.1), A1 (C24A1.2 DA3A1.2 R8A1.2)
PD1_ADC: Main (DD1.23), A1 (C28A1.1 R14A1.2)
PD1_ERR: Main (DD1.17), A1 (DA4A1.7), Protection (DD9.1)
PD2: Main (XP1.3), A2 (C24A2.2 DA3A2.2 R8A2.2)
PD2_ADC: Main (DD1.24), A2 (C28A2.1 R14A2.2)
PD2_ERR: Main (DD1.18), Protection (DD9.2), A2 (DA4A2.7)
POWER_IND: Main (DD1.1), Indication (R36.2)
PS_ERR1: Main (DD1.67), Power_supply (DD4.14)
PS_ERR2: Main (DD1.68), Power_supply (DD4.13)
PS_ON: Main (DD1.69), Power_supply (DD3.2)
Rx232: Main (DD1.48), Hardwiring (DD15.2)
RxCAN: Main (DD1.70), Power_supply (DD5.5)
T1: Main (XP1.5), A3 (R15A3.2 R16A3.1)
T1_ADC: Main (DD1.25), A3 (C30A3.1 R16A3.2)
T2: Main (XP1.7), A4 (R15A4.2 R16A4.1)
T2_ADC: Main (DD1.26), A4 (C30A4.1 R16A4.2)
Tx232: Main (DD1.47), Hardwiring (DD15.3)
TxCAN: Main (DD1.71), Power_supply (DD5.6)